# EAGLE design 32KRAM (EAGLE 6.6.0)

## Sheet 1 of 5
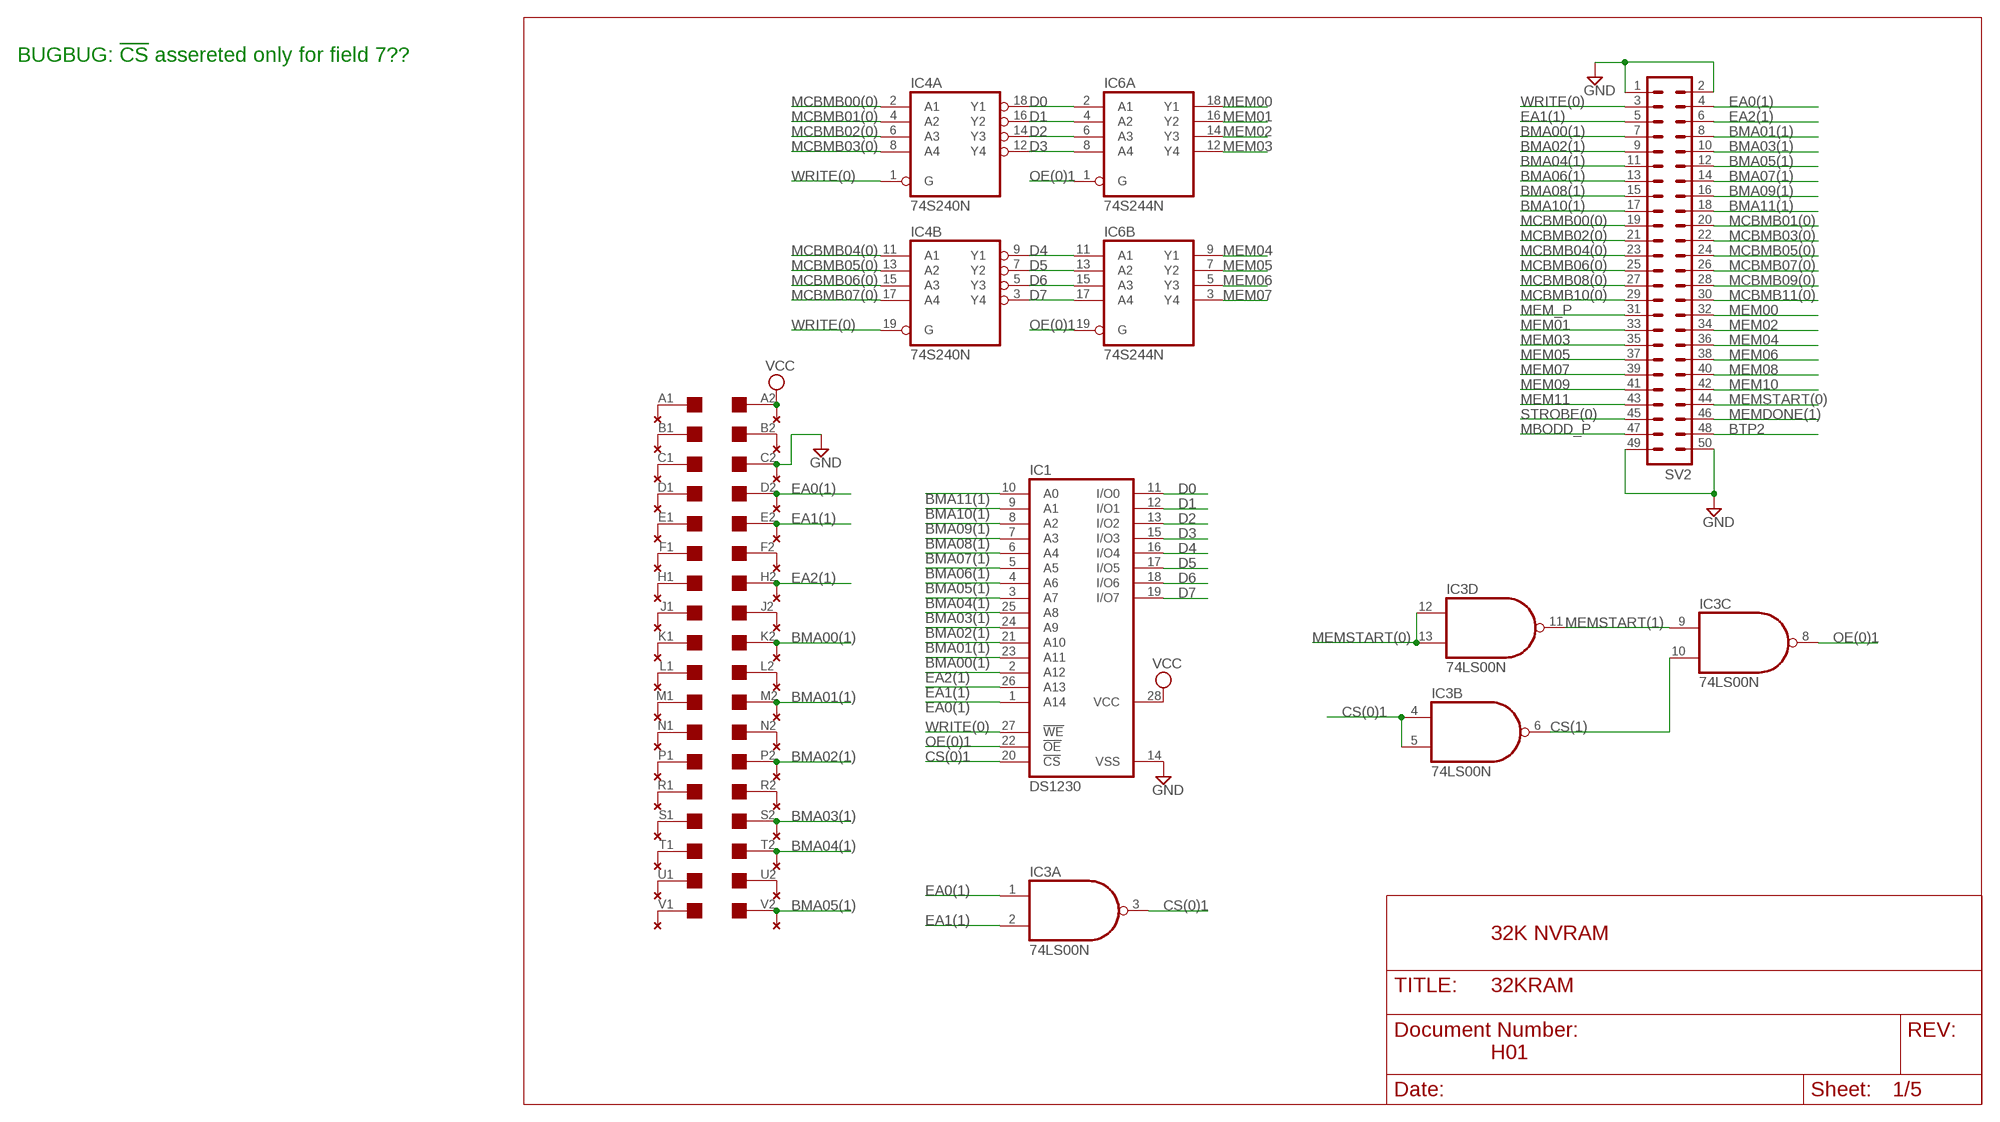
[diagram p0: schematic, sheet 1]

### Parts
EDGE1  EDGE-2CONNECTOR  [EDGE-CON2]
IC1  DS1230  62256P  [DIL28-6]
IC3  74LS00N  [DIL14]
IC4  74S240N  [DIL20]
IC6  74S244N  [DIL20]
SV2  ML50L  [ML50L]
U$1  THRU-HOLE2  [THRU-HOLEB]

### Nets
BMA00(1): EDGE1.K2 IC1.23(A11) SV2.7 U$1.K2 ; also sheet 2,3,5
BMA01(1): EDGE1.M2 IC1.21(A10) SV2.8 U$1.M2 ; also sheet 2,3,5
BMA02(1): EDGE1.P2 IC1.24(A9) SV2.9 U$1.P2 ; also sheet 2,3,5
BMA03(1): EDGE1.S2 IC1.25(A8) SV2.10 U$1.S2 ; also sheet 2,3,5
BMA04(1): EDGE1.T2 IC1.3(A7) SV2.11 U$1.T2 ; also sheet 2,3,5
BMA05(1): EDGE1.V2 IC1.4(A6) SV2.12 U$1.V2 ; also sheet 2,3,5
BMA06(1): IC1.5(A5) SV2.13 ; also sheet 2,3,5
BMA07(1): IC1.6(A4) SV2.14 ; also sheet 2,3,5
BMA08(1): IC1.7(A3) SV2.15 ; also sheet 2,3,5
BMA09(1): IC1.8(A2) SV2.16 ; also sheet 2,3,5
BMA10(1): IC1.9(A1) SV2.17 ; also sheet 2,3,5
BMA11(1): IC1.10(A0) SV2.18 ; also sheet 2,3,5
BTP2: SV2.48 ; also sheet 2,3,5
CS(0)1: IC1.20(!CS) IC3.3(A:O) IC3.4(B:I0) IC3.5(B:I1)
CS(1): IC3.6(B:O) IC3.10(C:I1)
D0: IC1.11(I/O0) IC4.18(A:Y1) IC6.2(A:A1)
D1: IC1.12(I/O1) IC4.16(A:Y2) IC6.4(A:A2)
D2: IC1.13(I/O2) IC4.14(A:Y3) IC6.6(A:A3)
D3: IC1.15(I/O3) IC4.12(A:Y4) IC6.8(A:A4)
D4: IC1.16(I/O4) IC4.9(B:Y1) IC6.11(B:A1)
D5: IC1.17(I/O5) IC4.7(B:Y2) IC6.13(B:A2)
D6: IC1.18(I/O6) IC4.5(B:Y3) IC6.15(B:A3)
D7: IC1.19(I/O7) IC4.3(B:Y4) IC6.17(B:A4)
EA0(1): EDGE1.D2 IC1.1(A14) IC3.1(A:I0) SV2.4 U$1.D2 ; also sheet 2,3,5
EA1(1): EDGE1.E2 IC1.26(A13) IC3.2(A:I1) SV2.5 U$1.E2 ; also sheet 2,3,5
EA2(1): EDGE1.H2 IC1.2(A12) SV2.6 U$1.H2 ; also sheet 2,3,5
GND: EDGE1.C2 IC1.14(VSS) SV2.1 SV2.2 SV2.49 SV2.50 U$1.C2 ; also sheet 2,3,5
MBODD_P: SV2.47 ; also sheet 2,3,5
MCBMB00(0): IC4.2(A:A1) SV2.19 ; also sheet 2,3,5
MCBMB01(0): IC4.4(A:A2) SV2.20 ; also sheet 2,3,5
MCBMB02(0): IC4.6(A:A3) SV2.21 ; also sheet 2,3,5
MCBMB03(0): IC4.8(A:A4) SV2.22 ; also sheet 2,3,5
MCBMB04(0): IC4.11(B:A1) SV2.23 ; also sheet 2,3,5
MCBMB05(0): IC4.13(B:A2) SV2.24 ; also sheet 2,3,5
MCBMB06(0): IC4.15(B:A3) SV2.25 ; also sheet 2,3,5
MCBMB07(0): IC4.17(B:A4) SV2.26 ; also sheet 2,3,5
MCBMB08(0): SV2.27 ; also sheet 2,3,5
MCBMB09(0): SV2.28 ; also sheet 2,3,5
MCBMB10(0): SV2.29 ; also sheet 2,3,5
MCBMB11(0): SV2.30 ; also sheet 2,3,5
MEM00: IC6.18(A:Y1) SV2.32 ; also sheet 2,3,5
MEM01: IC6.16(A:Y2) SV2.33 ; also sheet 2,3,5
MEM02: IC6.14(A:Y3) SV2.34 ; also sheet 2,3,5
MEM03: IC6.12(A:Y4) SV2.35 ; also sheet 2,3,5
MEM04: IC6.9(B:Y1) SV2.36 ; also sheet 2,3,5
MEM05: IC6.7(B:Y2) SV2.37 ; also sheet 2,3,5
MEM06: IC6.5(B:Y3) SV2.38 ; also sheet 2,3,5
MEM07: IC6.3(B:Y4) SV2.39 ; also sheet 2,3,5
MEM08: SV2.40 ; also sheet 2,3,5
MEM09: SV2.41 ; also sheet 2,3,5
MEM10: SV2.42 ; also sheet 2,3,5
MEM11: SV2.43 ; also sheet 2,3,5
MEM_P: SV2.31 ; also sheet 2,3,5
MEMDONE(1): SV2.46 ; also sheet 2,3,5
MEMSTART(0): IC3.12(D:I0) IC3.13(D:I1) SV2.44 ; also sheet 2,3,5
MEMSTART(1): IC3.9(C:I0) IC3.11(D:O)
N$1: EDGE1.L2 U$1.L2
N$3: EDGE1.N2 U$1.N2
N$5: EDGE1.R2 U$1.R2
N$9: EDGE1.J2 U$1.J2
N$11: EDGE1.F2 U$1.F2
N$15: EDGE1.U2 U$1.U2
N$17: EDGE1.B2 U$1.B2
N$19: EDGE1.K1 U$1.K1
N$20: EDGE1.L1 U$1.L1
N$21: EDGE1.M1 U$1.M1
N$22: EDGE1.N1 U$1.N1
N$23: EDGE1.P1 U$1.P1
N$24: EDGE1.R1 U$1.R1
N$25: EDGE1.S1 U$1.S1
N$26: EDGE1.T1 U$1.T1
N$27: EDGE1.U1 U$1.U1
N$28: EDGE1.V1 U$1.V1
N$29: EDGE1.J1 U$1.J1
N$30: EDGE1.H1 U$1.H1
N$31: EDGE1.F1 U$1.F1
N$32: EDGE1.E1 U$1.E1
N$33: EDGE1.D1 U$1.D1
N$34: EDGE1.C1 U$1.C1
N$35: EDGE1.B1 U$1.B1
N$36: EDGE1.A1 U$1.A1
OE(0)1: IC1.22(!OE) IC3.8(C:O) IC6.1(A:G) IC6.19(B:G)
STROBE(0): SV2.45 ; also sheet 2,3,5
VCC: EDGE1.A2 IC1.28(VCC) U$1.A2 ; also sheet 2,3,5
WRITE(0): IC1.27(!WE) IC4.1(A:G) IC4.19(B:G) SV2.3 ; also sheet 5

### Notes on the sheet
- BUGBUG: !CS! assereted only for field 7??
- 32K NVRAM
- H01

## Sheet 2 of 5
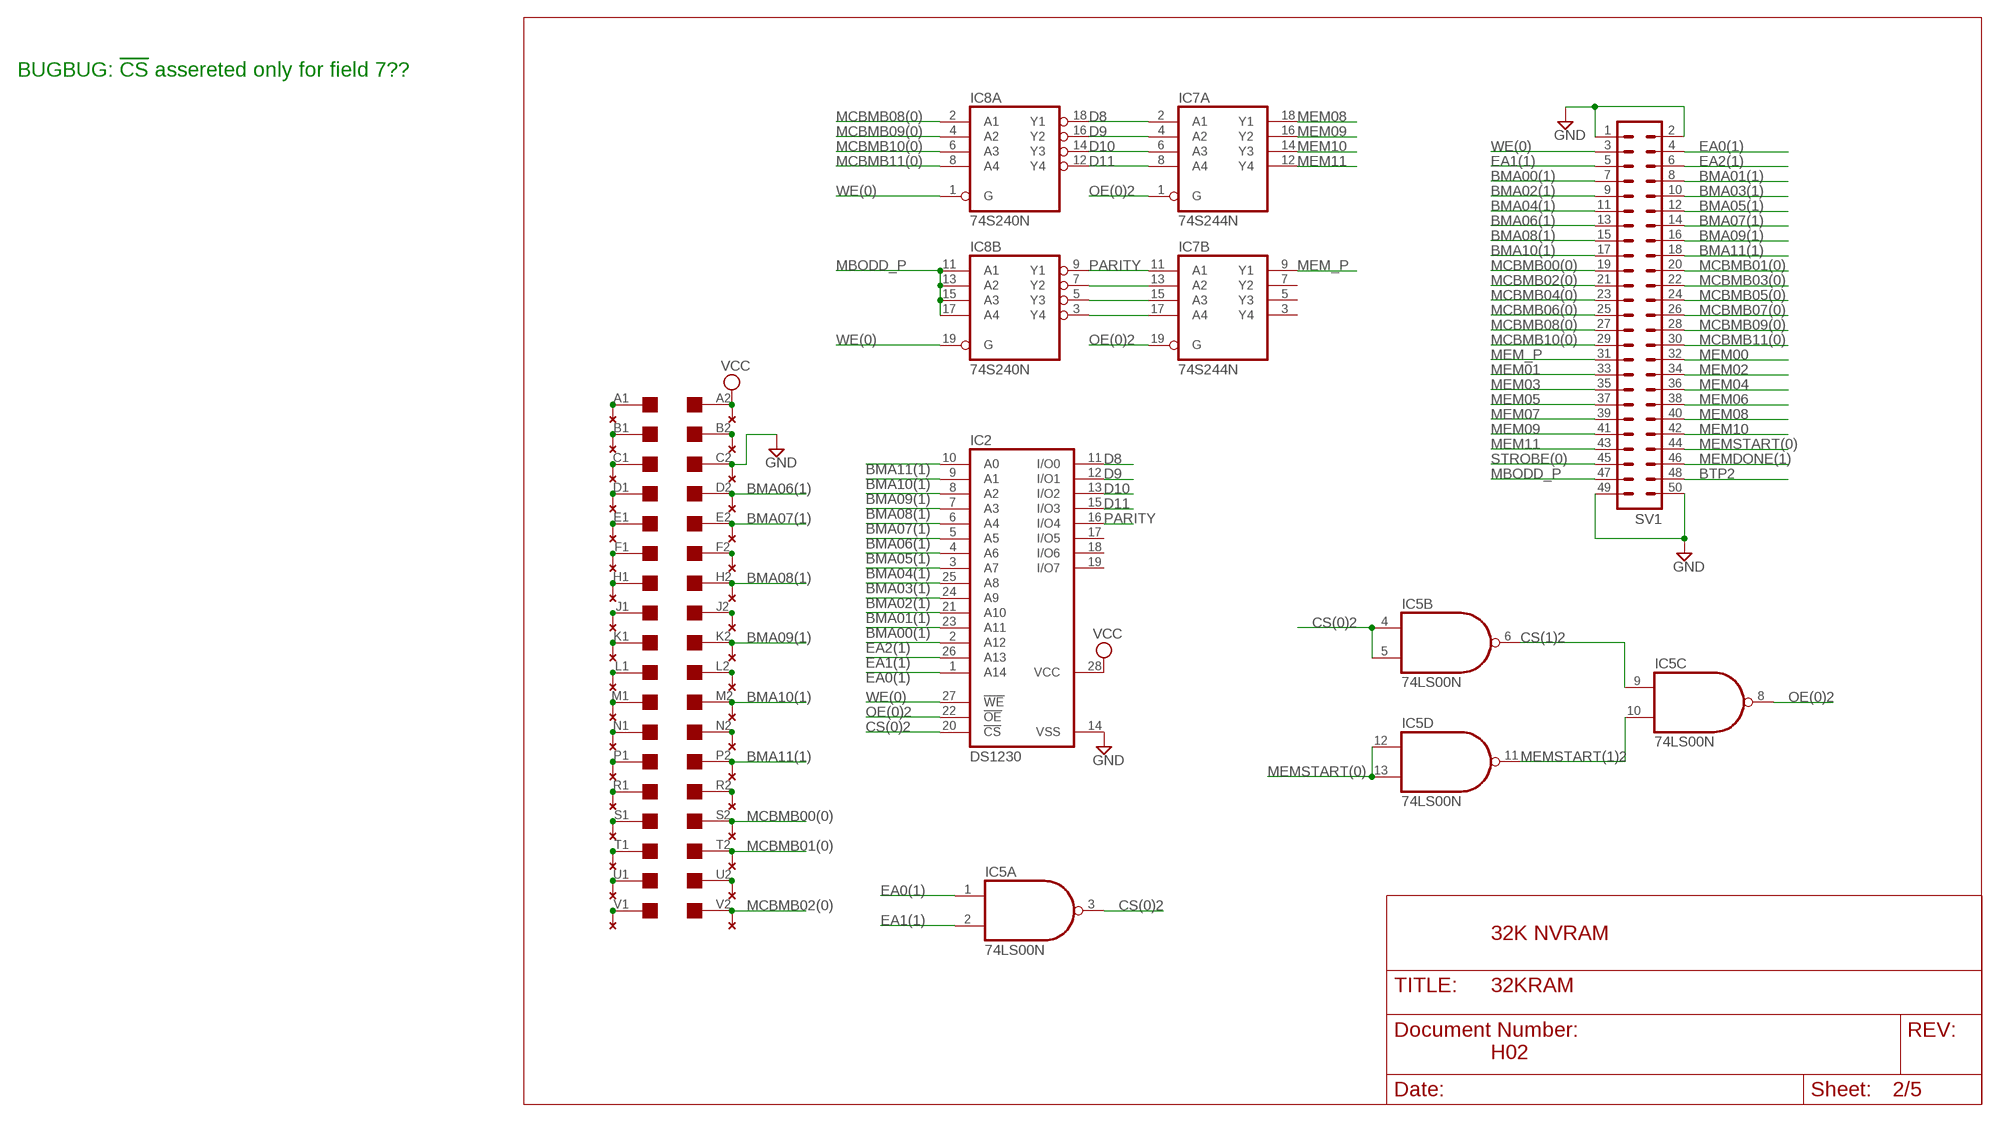
[diagram p1: schematic, sheet 2]

### Parts
EDGE2  EDGE-2CONNECTOR  [EDGE-CON2]
IC2  DS1230  62256P  [DIL28-6]
IC5  74LS00N  [DIL14]
IC7  74S244N  [DIL20]
IC8  74S240N  [DIL20]
SV1  ML50L  [ML50L]
U$2  THRU-HOLE2  [THRU-HOLEB]

### Nets
BMA00(1): IC2.23(A11) SV1.7 ; also sheet 1,3,5
BMA01(1): IC2.21(A10) SV1.8 ; also sheet 1,3,5
BMA02(1): IC2.24(A9) SV1.9 ; also sheet 1,3,5
BMA03(1): IC2.25(A8) SV1.10 ; also sheet 1,3,5
BMA04(1): IC2.3(A7) SV1.11 ; also sheet 1,3,5
BMA05(1): IC2.4(A6) SV1.12 ; also sheet 1,3,5
BMA06(1): EDGE2.D2 IC2.5(A5) SV1.13 U$2.D2 ; also sheet 1,3,5
BMA07(1): EDGE2.E2 IC2.6(A4) SV1.14 U$2.E2 ; also sheet 1,3,5
BMA08(1): EDGE2.H2 IC2.7(A3) SV1.15 U$2.H2 ; also sheet 1,3,5
BMA09(1): EDGE2.K2 IC2.8(A2) SV1.16 U$2.K2 ; also sheet 1,3,5
BMA10(1): EDGE2.M2 IC2.9(A1) SV1.17 U$2.M2 ; also sheet 1,3,5
BMA11(1): EDGE2.P2 IC2.10(A0) SV1.18 U$2.P2 ; also sheet 1,3,5
BTP2: SV1.48 ; also sheet 1,3,5
CS(0)2: IC2.20(!CS) IC5.3(A:O) IC5.4(B:I0) IC5.5(B:I1)
CS(1)2: IC5.6(B:O) IC5.9(C:I0)
D8: IC2.11(I/O0) IC7.2(A:A1) IC8.18(A:Y1)
D9: IC2.12(I/O1) IC7.4(A:A2) IC8.16(A:Y2)
D10: IC2.13(I/O2) IC7.6(A:A3) IC8.14(A:Y3)
D11: IC2.15(I/O3) IC7.8(A:A4) IC8.12(A:Y4)
EA0(1): IC2.1(A14) IC5.1(A:I0) SV1.4 ; also sheet 1,3,5
EA1(1): IC2.26(A13) IC5.2(A:I1) SV1.5 ; also sheet 1,3,5
EA2(1): IC2.2(A12) SV1.6 ; also sheet 1,3,5
GND: EDGE2.C2 IC2.14(VSS) SV1.1 SV1.2 SV1.49 SV1.50 U$2.C2 ; also sheet 1,3,5
MBODD_P: IC8.11(B:A1) IC8.13(B:A2) IC8.15(B:A3) IC8.17(B:A4) SV1.47 ; also sheet 1,3,5
MCBMB00(0): EDGE2.S2 SV1.19 U$2.S2 ; also sheet 1,3,5
MCBMB01(0): EDGE2.T2 SV1.20 U$2.T2 ; also sheet 1,3,5
MCBMB02(0): EDGE2.V2 SV1.21 U$2.V2 ; also sheet 1,3,5
MCBMB03(0): SV1.22 ; also sheet 1,3,5
MCBMB04(0): SV1.23 ; also sheet 1,3,5
MCBMB05(0): SV1.24 ; also sheet 1,3,5
MCBMB06(0): SV1.25 ; also sheet 1,3,5
MCBMB07(0): SV1.26 ; also sheet 1,3,5
MCBMB08(0): IC8.2(A:A1) SV1.27 ; also sheet 1,3,5
MCBMB09(0): IC8.4(A:A2) SV1.28 ; also sheet 1,3,5
MCBMB10(0): IC8.6(A:A3) SV1.29 ; also sheet 1,3,5
MCBMB11(0): IC8.8(A:A4) SV1.30 ; also sheet 1,3,5
MEM00: SV1.32 ; also sheet 1,3,5
MEM01: SV1.33 ; also sheet 1,3,5
MEM02: SV1.34 ; also sheet 1,3,5
MEM03: SV1.35 ; also sheet 1,3,5
MEM04: SV1.36 ; also sheet 1,3,5
MEM05: SV1.37 ; also sheet 1,3,5
MEM06: SV1.38 ; also sheet 1,3,5
MEM07: SV1.39 ; also sheet 1,3,5
MEM08: IC7.18(A:Y1) SV1.40 ; also sheet 1,3,5
MEM09: IC7.16(A:Y2) SV1.41 ; also sheet 1,3,5
MEM10: IC7.14(A:Y3) SV1.42 ; also sheet 1,3,5
MEM11: IC7.12(A:Y4) SV1.43 ; also sheet 1,3,5
MEM_P: IC7.9(B:Y1) SV1.31 ; also sheet 1,3,5
MEMDONE(1): SV1.46 ; also sheet 1,3,5
MEMSTART(0): IC5.12(D:I0) IC5.13(D:I1) SV1.44 ; also sheet 1,3,5
MEMSTART(1)2: IC5.10(C:I1) IC5.11(D:O)
N$2: IC7.13(B:A2) IC8.7(B:Y2)
N$4: IC7.15(B:A3) IC8.5(B:Y3)
N$6: IC7.17(B:A4) IC8.3(B:Y4)
N$7: EDGE2.L2 U$2.L2
N$8: EDGE2.N2 U$2.N2
N$10: EDGE2.R2 U$2.R2
N$12: EDGE2.J2 U$2.J2
N$13: EDGE2.F2 U$2.F2
N$14: EDGE2.U2 U$2.U2
N$16: EDGE2.B2 U$2.B2
N$18: EDGE2.K1 U$2.K1
N$37: EDGE2.L1 U$2.L1
N$38: EDGE2.M1 U$2.M1
N$39: EDGE2.N1 U$2.N1
N$40: EDGE2.P1 U$2.P1
N$41: EDGE2.R1 U$2.R1
N$42: EDGE2.S1 U$2.S1
N$43: EDGE2.T1 U$2.T1
N$47: EDGE2.U1 U$2.U1
N$48: EDGE2.V1 U$2.V1
N$49: EDGE2.J1 U$2.J1
N$50: EDGE2.H1 U$2.H1
N$51: EDGE2.F1 U$2.F1
N$52: EDGE2.E1 U$2.E1
N$53: EDGE2.D1 U$2.D1
N$54: EDGE2.C1 U$2.C1
N$55: EDGE2.B1 U$2.B1
N$56: EDGE2.A1 U$2.A1
OE(0)2: IC2.22(!OE) IC5.8(C:O) IC7.1(A:G) IC7.19(B:G)
PARITY: IC2.16(I/O4) IC7.11(B:A1) IC8.9(B:Y1)
STROBE(0): SV1.45 ; also sheet 1,3,5
VCC: EDGE2.A2 IC2.28(VCC) U$2.A2 ; also sheet 1,3,5
WE(0): IC2.27(!WE) IC8.1(A:G) IC8.19(B:G) SV1.3 ; also sheet 3
Unconnected: IC2.17(I/O5) IC2.18(I/O6) IC2.19(I/O7) IC7.3(B:Y4) IC7.5(B:Y3) IC7.7(B:Y2)

### Notes on the sheet
- BUGBUG: !CS! assereted only for field 7??
- 32K NVRAM
- H02

## Sheet 3 of 5
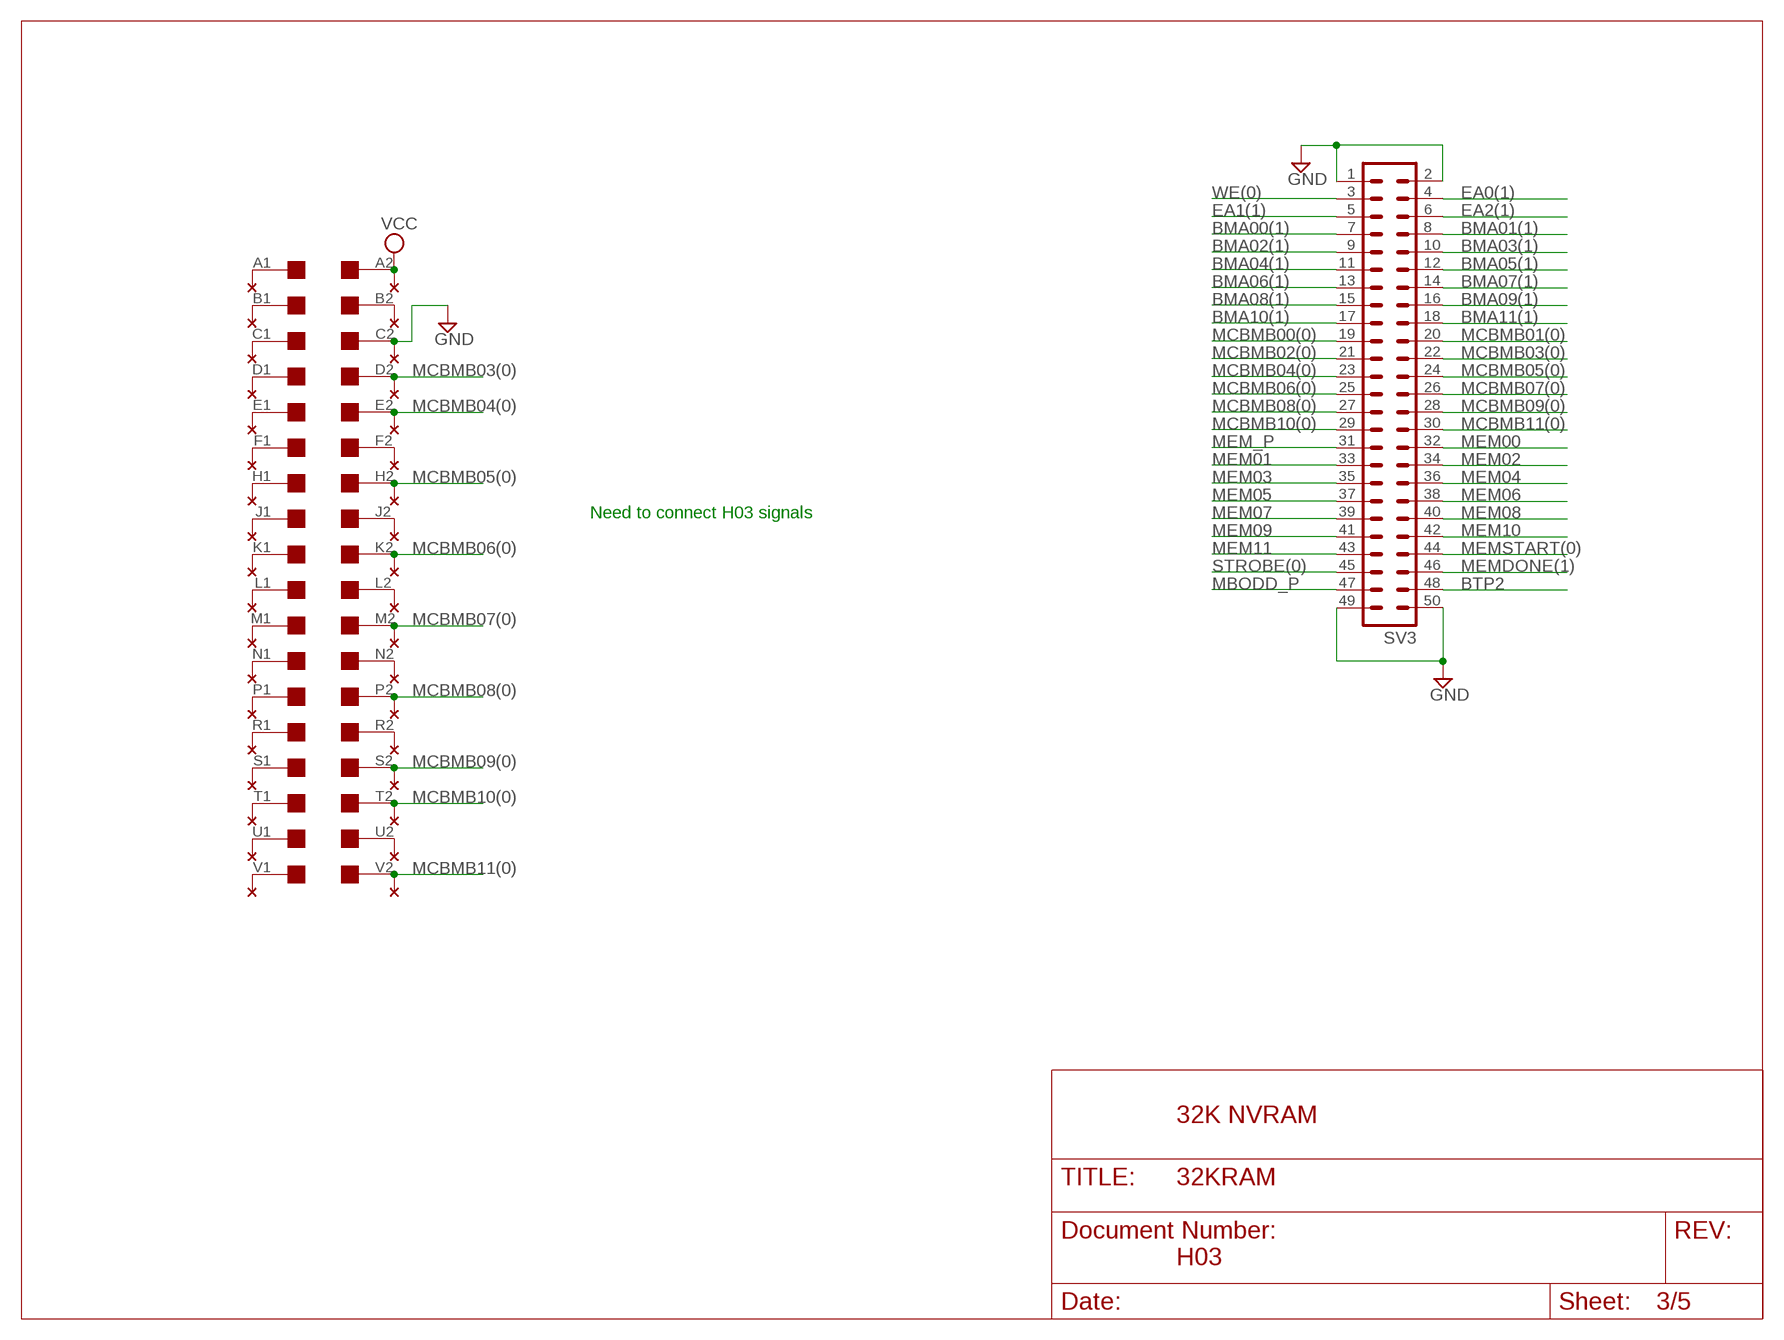
[diagram p2: schematic, sheet 3]

### Parts
EDGE3  EDGE-2CONNECTOR  [EDGE-CON2]
SV3  ML50L  [ML50L]
U$3  THRU-HOLE2  [THRU-HOLEB]

### Nets
BMA00(1): SV3.7 ; also sheet 1,2,5
BMA01(1): SV3.8 ; also sheet 1,2,5
BMA02(1): SV3.9 ; also sheet 1,2,5
BMA03(1): SV3.10 ; also sheet 1,2,5
BMA04(1): SV3.11 ; also sheet 1,2,5
BMA05(1): SV3.12 ; also sheet 1,2,5
BMA06(1): SV3.13 ; also sheet 1,2,5
BMA07(1): SV3.14 ; also sheet 1,2,5
BMA08(1): SV3.15 ; also sheet 1,2,5
BMA09(1): SV3.16 ; also sheet 1,2,5
BMA10(1): SV3.17 ; also sheet 1,2,5
BMA11(1): SV3.18 ; also sheet 1,2,5
BTP2: SV3.48 ; also sheet 1,2,5
EA0(1): SV3.4 ; also sheet 1,2,5
EA1(1): SV3.5 ; also sheet 1,2,5
EA2(1): SV3.6 ; also sheet 1,2,5
GND: EDGE3.C2 SV3.1 SV3.2 SV3.49 SV3.50 U$3.C2 ; also sheet 1,2,5
MBODD_P: SV3.47 ; also sheet 1,2,5
MCBMB00(0): SV3.19 ; also sheet 1,2,5
MCBMB01(0): SV3.20 ; also sheet 1,2,5
MCBMB02(0): SV3.21 ; also sheet 1,2,5
MCBMB03(0): EDGE3.D2 SV3.22 U$3.D2 ; also sheet 1,2,5
MCBMB04(0): EDGE3.E2 SV3.23 U$3.E2 ; also sheet 1,2,5
MCBMB05(0): EDGE3.H2 SV3.24 U$3.H2 ; also sheet 1,2,5
MCBMB06(0): EDGE3.K2 SV3.25 U$3.K2 ; also sheet 1,2,5
MCBMB07(0): EDGE3.M2 SV3.26 U$3.M2 ; also sheet 1,2,5
MCBMB08(0): EDGE3.P2 SV3.27 U$3.P2 ; also sheet 1,2,5
MCBMB09(0): EDGE3.S2 SV3.28 U$3.S2 ; also sheet 1,2,5
MCBMB10(0): EDGE3.T2 SV3.29 U$3.T2 ; also sheet 1,2,5
MCBMB11(0): EDGE3.V2 SV3.30 U$3.V2 ; also sheet 1,2,5
MEM00: SV3.32 ; also sheet 1,2,5
MEM01: SV3.33 ; also sheet 1,2,5
MEM02: SV3.34 ; also sheet 1,2,5
MEM03: SV3.35 ; also sheet 1,2,5
MEM04: SV3.36 ; also sheet 1,2,5
MEM05: SV3.37 ; also sheet 1,2,5
MEM06: SV3.38 ; also sheet 1,2,5
MEM07: SV3.39 ; also sheet 1,2,5
MEM08: SV3.40 ; also sheet 1,2,5
MEM09: SV3.41 ; also sheet 1,2,5
MEM10: SV3.42 ; also sheet 1,2,5
MEM11: SV3.43 ; also sheet 1,2,5
MEM_P: SV3.31 ; also sheet 1,2,5
MEMDONE(1): SV3.46 ; also sheet 1,2,5
MEMSTART(0): SV3.44 ; also sheet 1,2,5
N$57: EDGE3.J2 U$3.J2
N$58: EDGE3.L2 U$3.L2
N$59: EDGE3.N2 U$3.N2
N$60: EDGE3.F2 U$3.F2
N$61: EDGE3.R2 U$3.R2
N$62: EDGE3.B2 U$3.B2
N$63: EDGE3.U2 U$3.U2
N$64: EDGE3.A1 U$3.A1
N$65: EDGE3.V1 U$3.V1
N$66: EDGE3.U1 U$3.U1
N$67: EDGE3.T1 U$3.T1
N$68: EDGE3.S1 U$3.S1
N$69: EDGE3.R1 U$3.R1
N$70: EDGE3.P1 U$3.P1
N$71: EDGE3.N1 U$3.N1
N$72: EDGE3.M1 U$3.M1
N$73: EDGE3.L1 U$3.L1
N$74: EDGE3.K1 U$3.K1
N$75: EDGE3.J1 U$3.J1
N$76: EDGE3.H1 U$3.H1
N$77: EDGE3.F1 U$3.F1
N$78: EDGE3.E1 U$3.E1
N$79: EDGE3.D1 U$3.D1
N$80: EDGE3.C1 U$3.C1
N$81: EDGE3.B1 U$3.B1
STROBE(0): SV3.45 ; also sheet 1,2,5
VCC: EDGE3.A2 U$3.A2 ; also sheet 1,2,5
WE(0): SV3.3 ; also sheet 2

### Notes on the sheet
- Need to connect H03 signals
- 32K NVRAM
- H03

## Sheet 4 of 5
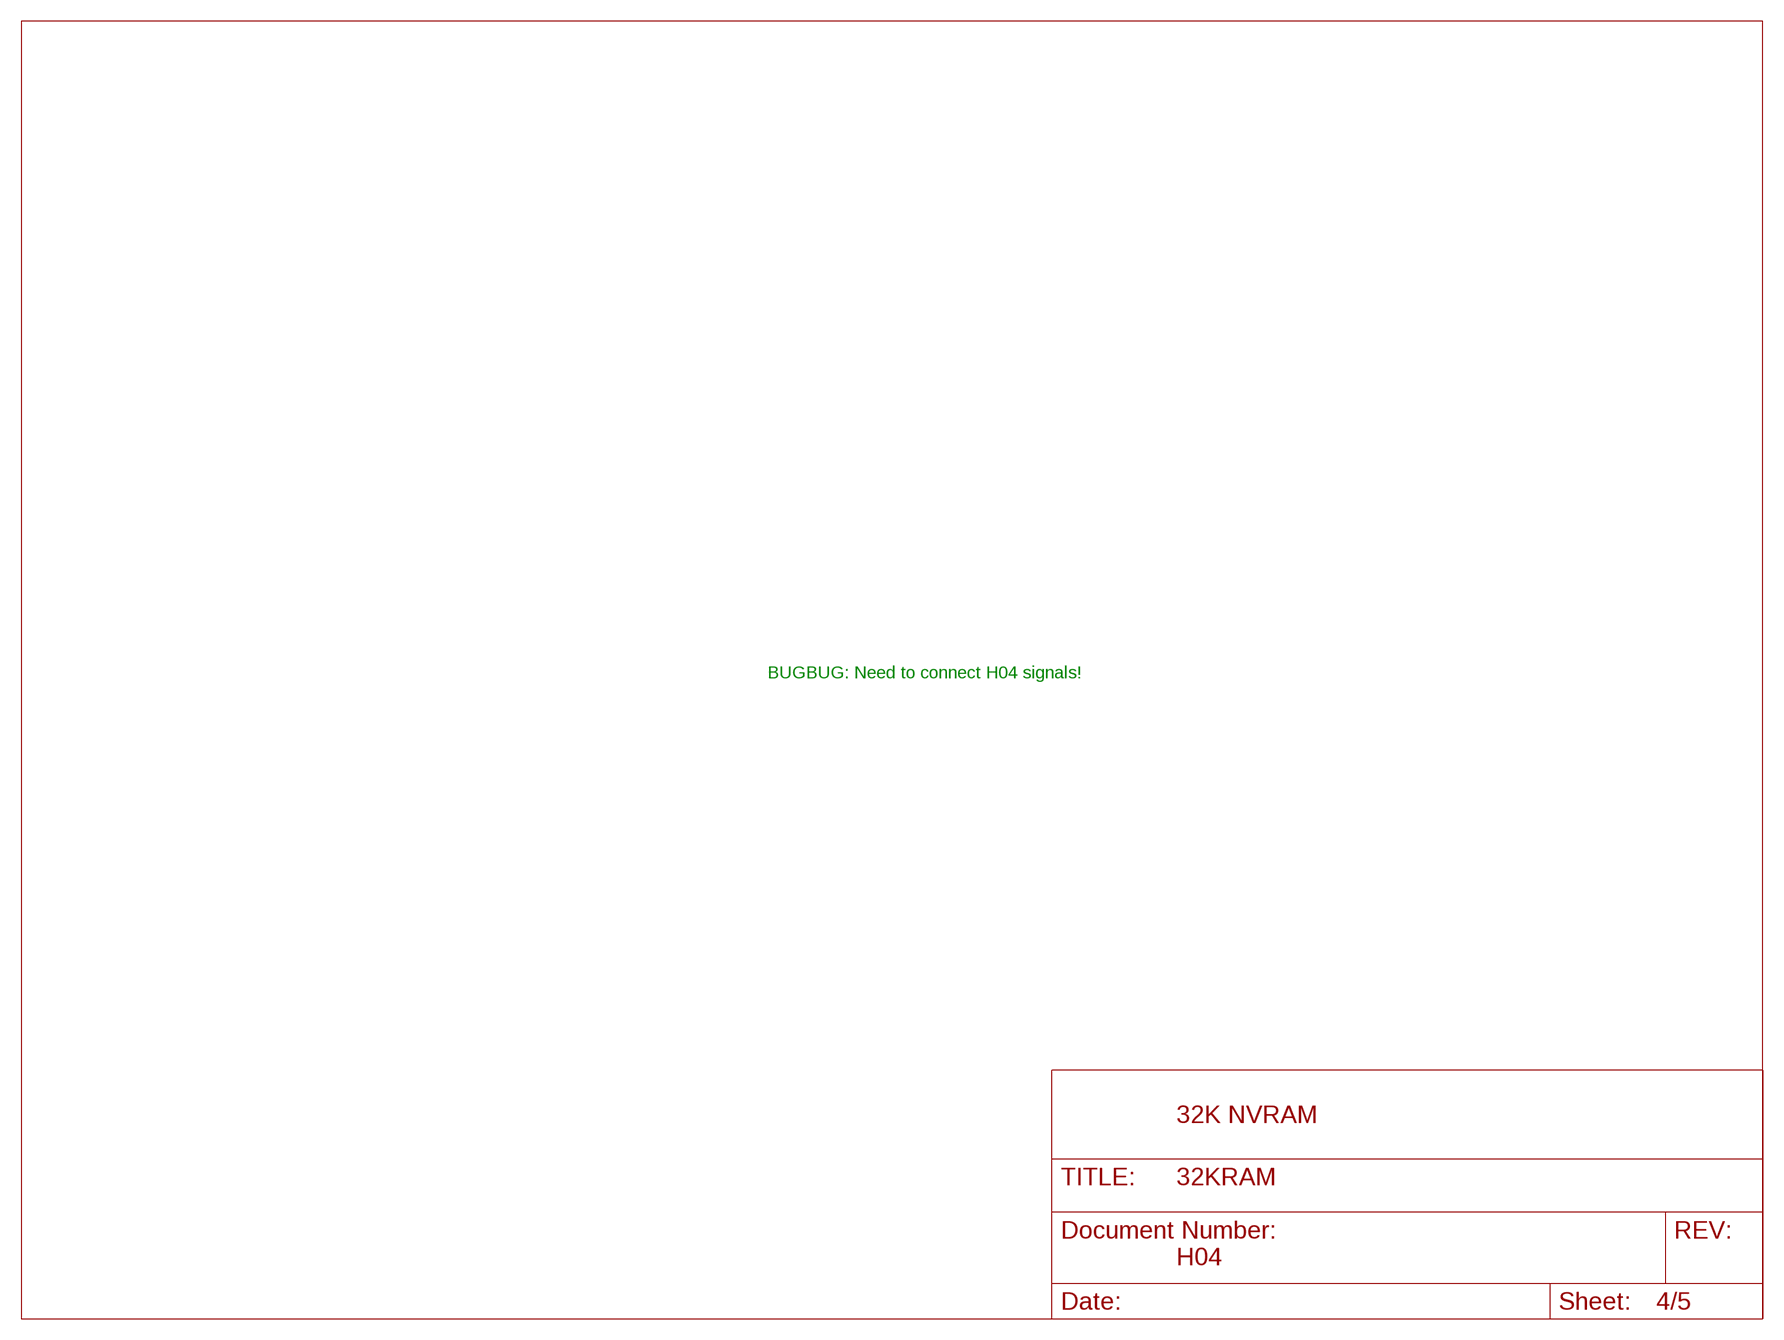
[diagram p3: schematic, sheet 4]

### Notes on the sheet
- BUGBUG: Need to connect H04 signals!
- 32K NVRAM
- H04

## Sheet 5 of 5
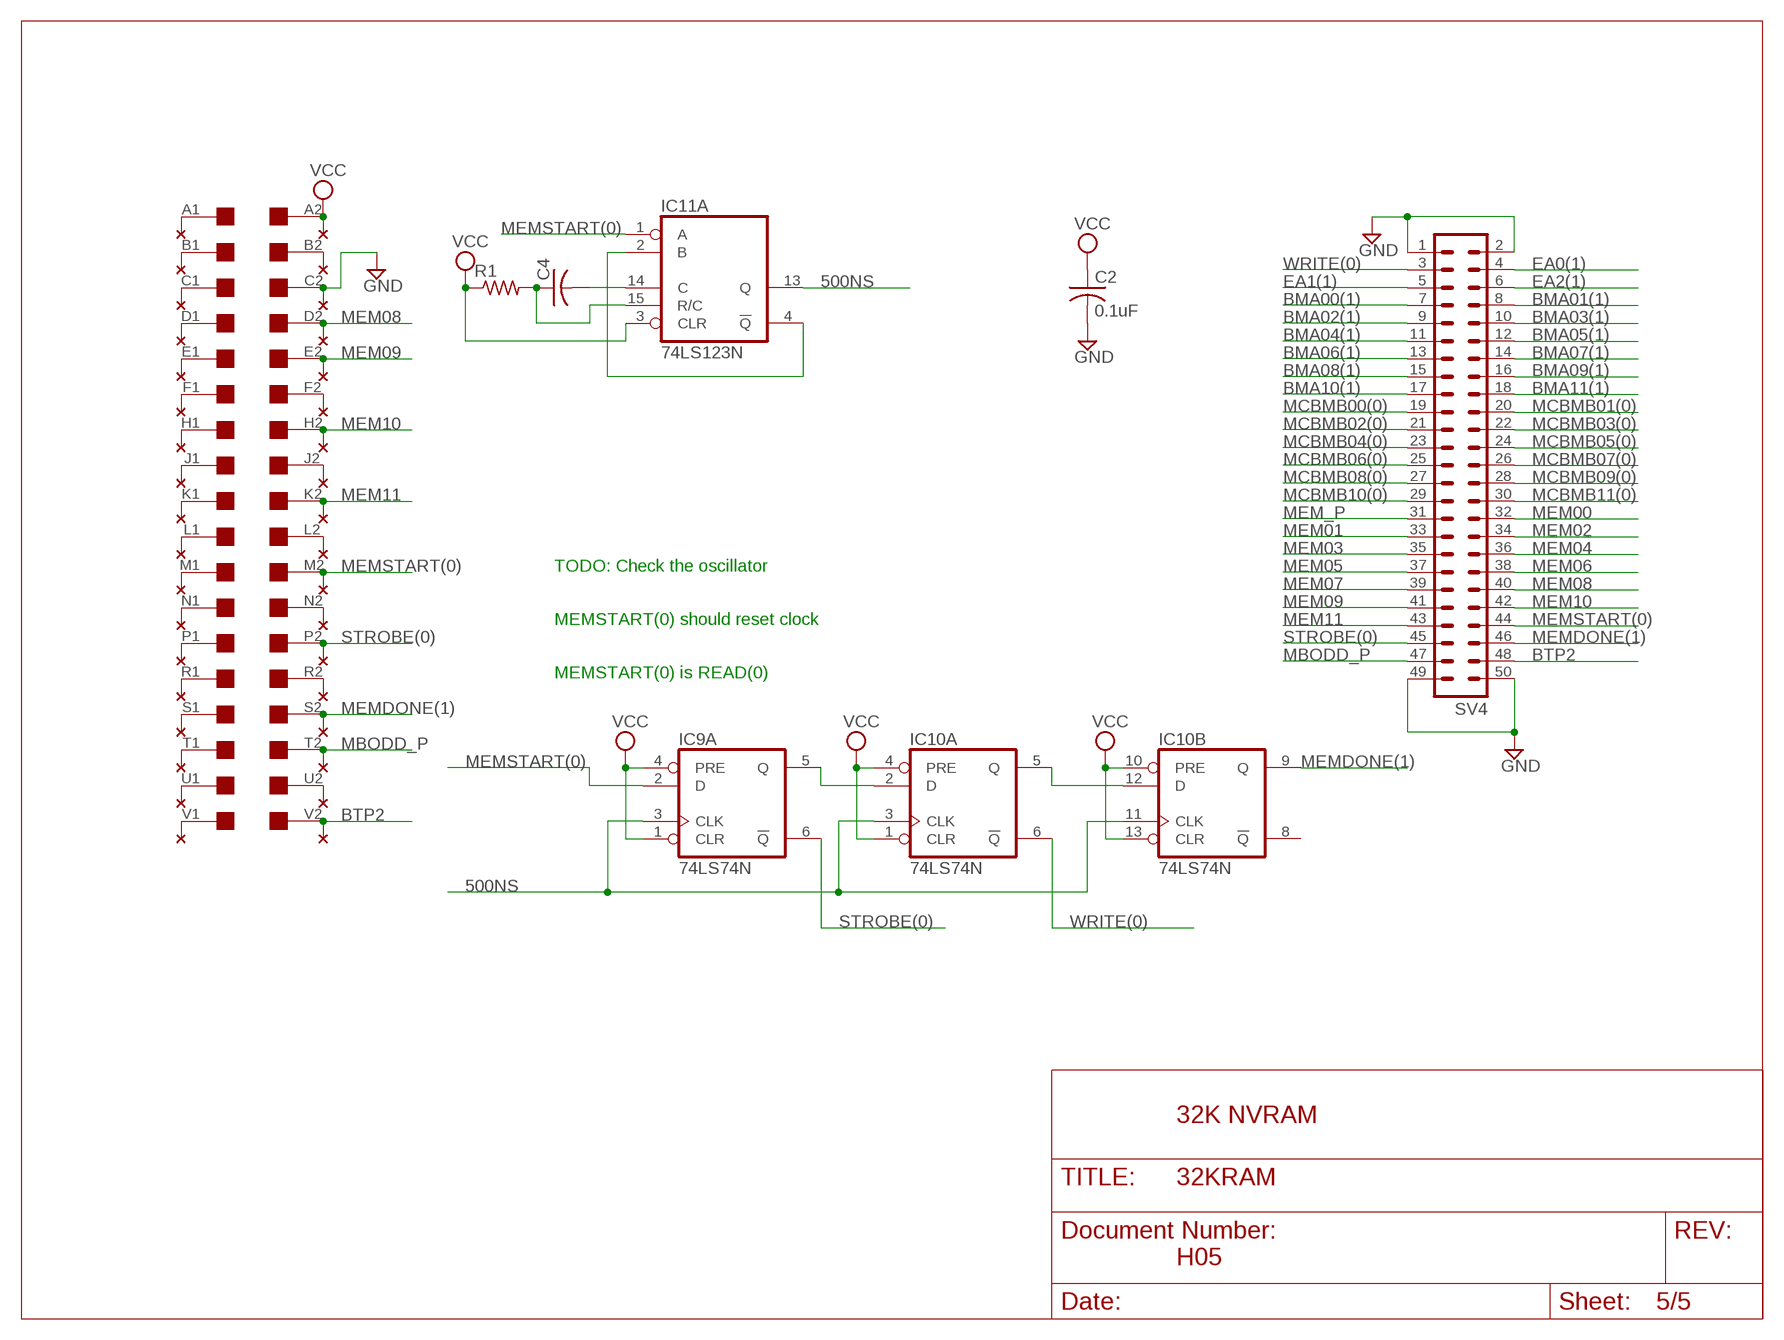
[diagram p4: schematic, sheet 5]

### Parts
C2  0.1uF  C-US050-025X075  [C050-025X075]
C4  C-US050-025X075  [C050-025X075]
EDGE5  EDGE-2CONNECTOR  [EDGE-CON2]
IC9  74LS74N  [DIL14]
IC10  74LS74N  [DIL14]
IC11  74LS123N  [DIL16]
R1  R-US_0309/10  [0309/10]
SV4  ML50L  [ML50L]
U$5  THRU-HOLE2  [THRU-HOLEB]

### Nets
500NS: IC9.3(A:CLK) IC10.3(A:CLK) IC10.11(B:CLK) IC11.13(A:Q)
BMA00(1): SV4.7 ; also sheet 1,2,3
BMA01(1): SV4.8 ; also sheet 1,2,3
BMA02(1): SV4.9 ; also sheet 1,2,3
BMA03(1): SV4.10 ; also sheet 1,2,3
BMA04(1): SV4.11 ; also sheet 1,2,3
BMA05(1): SV4.12 ; also sheet 1,2,3
BMA06(1): SV4.13 ; also sheet 1,2,3
BMA07(1): SV4.14 ; also sheet 1,2,3
BMA08(1): SV4.15 ; also sheet 1,2,3
BMA09(1): SV4.16 ; also sheet 1,2,3
BMA10(1): SV4.17 ; also sheet 1,2,3
BMA11(1): SV4.18 ; also sheet 1,2,3
BTP2: EDGE5.V2 SV4.48 U$5.V2 ; also sheet 1,2,3
EA0(1): SV4.4 ; also sheet 1,2,3
EA1(1): SV4.5 ; also sheet 1,2,3
EA2(1): SV4.6 ; also sheet 1,2,3
GND: C2.2 EDGE5.C2 SV4.1 SV4.2 SV4.49 SV4.50 U$5.C2 ; also sheet 1,2,3
MBODD_P: EDGE5.T2 SV4.47 U$5.T2 ; also sheet 1,2,3
MCBMB00(0): SV4.19 ; also sheet 1,2,3
MCBMB01(0): SV4.20 ; also sheet 1,2,3
MCBMB02(0): SV4.21 ; also sheet 1,2,3
MCBMB03(0): SV4.22 ; also sheet 1,2,3
MCBMB04(0): SV4.23 ; also sheet 1,2,3
MCBMB05(0): SV4.24 ; also sheet 1,2,3
MCBMB06(0): SV4.25 ; also sheet 1,2,3
MCBMB07(0): SV4.26 ; also sheet 1,2,3
MCBMB08(0): SV4.27 ; also sheet 1,2,3
MCBMB09(0): SV4.28 ; also sheet 1,2,3
MCBMB10(0): SV4.29 ; also sheet 1,2,3
MCBMB11(0): SV4.30 ; also sheet 1,2,3
MEM00: SV4.32 ; also sheet 1,2,3
MEM01: SV4.33 ; also sheet 1,2,3
MEM02: SV4.34 ; also sheet 1,2,3
MEM03: SV4.35 ; also sheet 1,2,3
MEM04: SV4.36 ; also sheet 1,2,3
MEM05: SV4.37 ; also sheet 1,2,3
MEM06: SV4.38 ; also sheet 1,2,3
MEM07: SV4.39 ; also sheet 1,2,3
MEM08: EDGE5.D2 SV4.40 U$5.D2 ; also sheet 1,2,3
MEM09: EDGE5.E2 SV4.41 U$5.E2 ; also sheet 1,2,3
MEM10: EDGE5.H2 SV4.42 U$5.H2 ; also sheet 1,2,3
MEM11: EDGE5.K2 SV4.43 U$5.K2 ; also sheet 1,2,3
MEM_P: SV4.31 ; also sheet 1,2,3
MEMDONE(1): EDGE5.S2 IC10.9(B:Q) SV4.46 U$5.S2 ; also sheet 1,2,3
MEMSTART(0): EDGE5.M2 IC9.2(A:D) IC11.1(A:A) SV4.44 U$5.M2 ; also sheet 1,2,3
N$82: IC9.5(A:Q) IC10.2(A:D)
N$83: IC10.5(A:Q) IC10.12(B:D)
N$84: IC11.2(A:B) IC11.4(A:!Q)
N$85: C4.2 IC11.14(A:C)
N$86: C4.1 IC11.15(A:R/C) R1.2
N$87: EDGE5.J2 U$5.J2
N$88: EDGE5.L2 U$5.L2
N$89: EDGE5.N2 U$5.N2
N$90: EDGE5.F2 U$5.F2
N$91: EDGE5.R2 U$5.R2
N$92: EDGE5.B2 U$5.B2
N$93: EDGE5.U2 U$5.U2
N$94: EDGE5.A1 U$5.A1
N$95: EDGE5.V1 U$5.V1
N$96: EDGE5.U1 U$5.U1
N$97: EDGE5.T1 U$5.T1
N$98: EDGE5.S1 U$5.S1
N$99: EDGE5.R1 U$5.R1
N$100: EDGE5.P1 U$5.P1
N$101: EDGE5.N1 U$5.N1
N$102: EDGE5.M1 U$5.M1
N$103: EDGE5.L1 U$5.L1
N$104: EDGE5.K1 U$5.K1
N$105: EDGE5.J1 U$5.J1
N$106: EDGE5.H1 U$5.H1
N$107: EDGE5.F1 U$5.F1
N$108: EDGE5.E1 U$5.E1
N$109: EDGE5.D1 U$5.D1
N$110: EDGE5.C1 U$5.C1
N$111: EDGE5.B1 U$5.B1
STROBE(0): EDGE5.P2 IC9.6(A:!Q) SV4.45 U$5.P2 ; also sheet 1,2,3
VCC: C2.1 EDGE5.A2 IC9.1(A:CLR) IC9.4(A:PRE) IC10.1(A:CLR) IC10.4(A:PRE) IC10.10(B:PRE) IC10.13(B:CLR) IC11.3(A:CLR) R1.1 U$5.A2 ; also sheet 1,2,3
WRITE(0): IC10.6(A:!Q) SV4.3 ; also sheet 1
Unconnected: IC9.8(B:!Q) IC9.9(B:Q) IC9.10(B:PRE) IC9.11(B:CLK) IC9.12(B:D) IC9.13(B:CLR) IC10.8(B:!Q) IC11.5(B:Q) IC11.6(B:C) IC11.7(B:R/C) IC11.9(B:A) IC11.10(B:B) IC11.11(B:CLR) IC11.12(B:!Q)

### Notes on the sheet
- TODO: Check the oscillator
- MEMSTART(0) should reset clock
- MEMSTART(0) is READ(0)
- 32K NVRAM
- H05

## Power pins joined to a net without a drawn wire
GND: IC3.7(P:GND) IC4.10(P:GND) IC5.7(P:GND) IC6.10(P:GND) IC7.10(P:GND) IC8.10(P:GND) IC9.7(P:GND) IC10.7(P:GND) IC11.8(P:GND)
VCC: IC3.14(P:VCC) IC4.20(P:VCC) IC5.14(P:VCC) IC6.20(P:VCC) IC7.20(P:VCC) IC8.20(P:VCC) IC9.14(P:VCC) IC10.14(P:VCC) IC11.16(P:VCC)

## Library data of the parts
C2 C4 = rcl:C-US: CAPACITOR, American symbol
EDGE1-EDGE3 EDGE5 = dec-con:EDGE-2: Double-Sided DEC edge connector.
IC1 IC2 = memory-hitachi:62256P: MEMORY; OC_FARNELL: unknown; OC_NEWARK: unknown
IC3 IC5 = 74xx-us:74*00: Quad 2-input NAND gate
IC4 IC8 = 74xx-us:74*240: Octal BUFFER and LINE DRIVER, 3-state
IC6 IC7 = 74xx-us:74*244: Octal BUFFER and LINE DRIVER, 3-state
IC9 IC10 = 74xx-us:74*74: Dual D type positive edge triggered FLIP FLOP, preset and clear
IC11 = 74xx-us:74*123: Retriggerable monostable MULTIVIBRATOR
R1 = rcl:R-US_: RESISTOR, American symbol
SV1-SV4 = con-ml:ML50L: HARTING; OC_FARNELL: unknown; OC_NEWARK: unknown
U$1-U$3 U$5 = dec-con:THRU-HOLE2: Thru-Hole addition to double-sided edge connector.

## Board
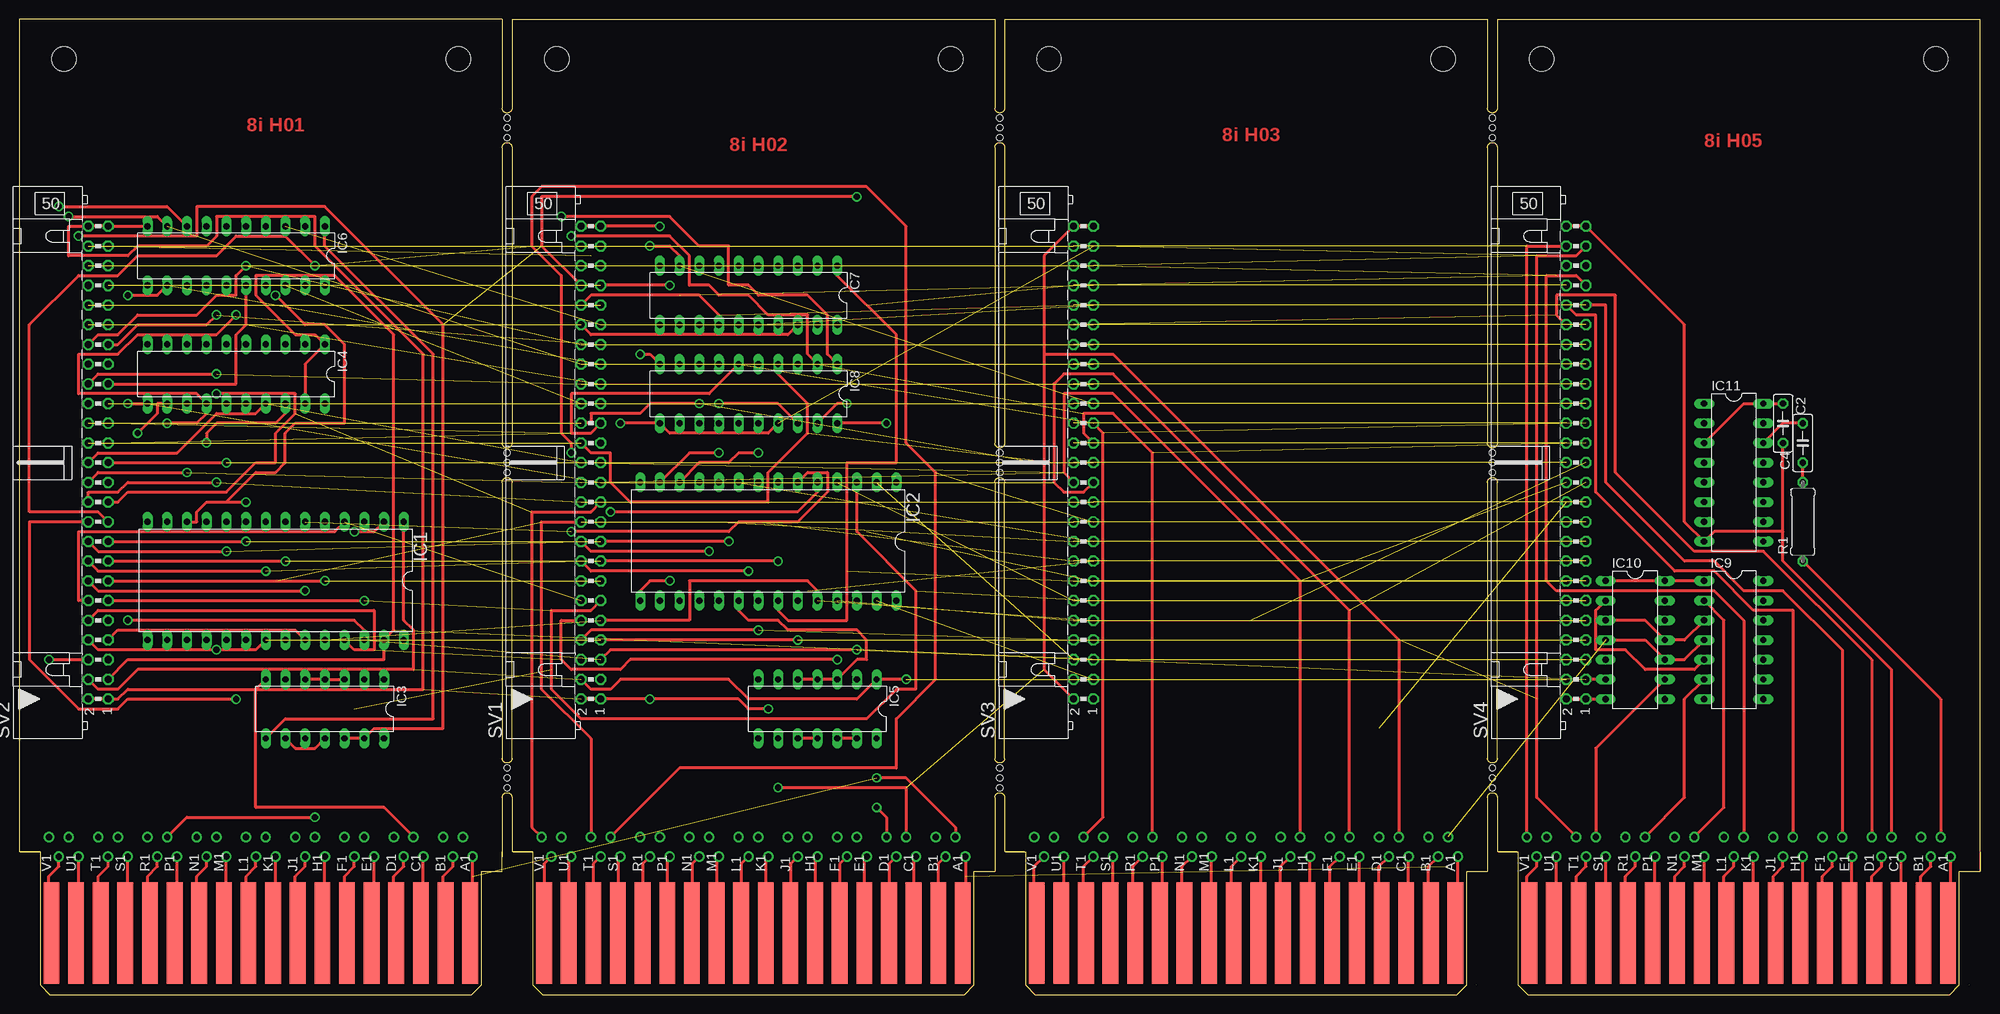
[diagram p5: board, top side]
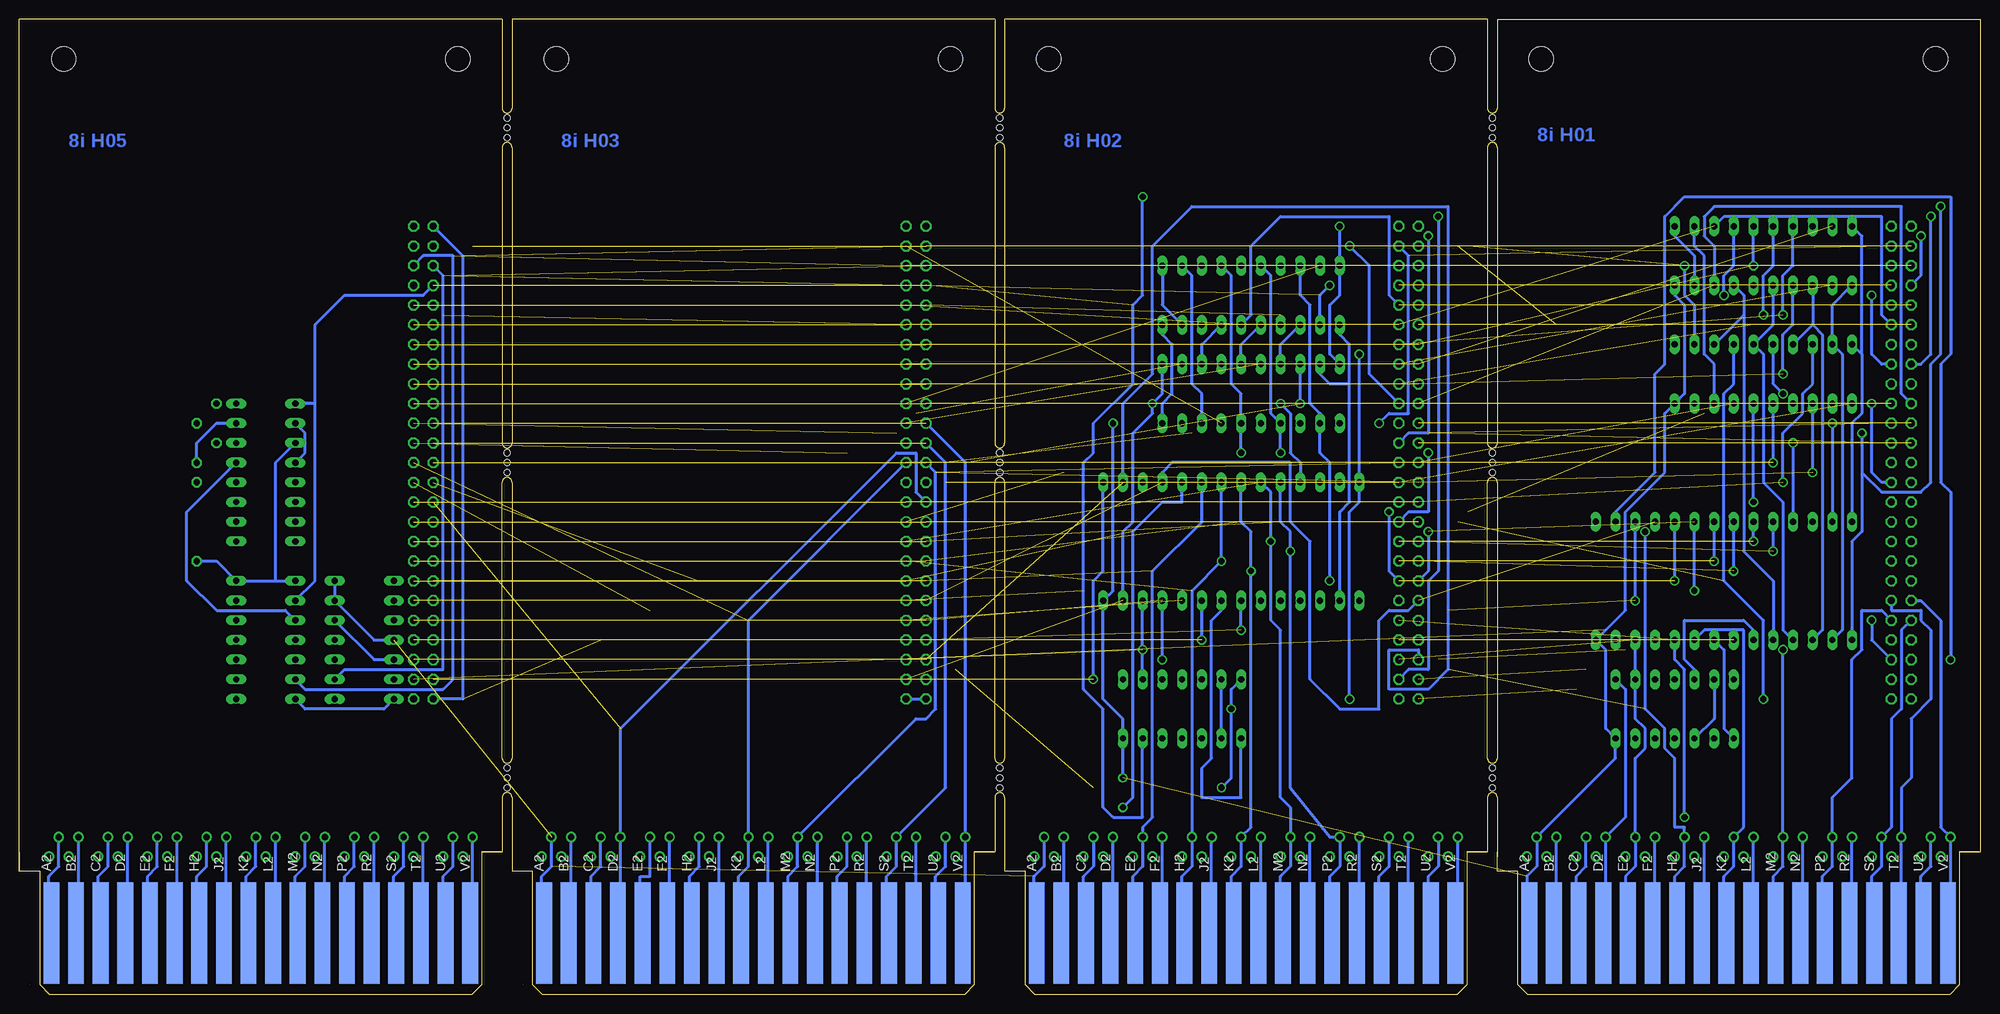
[diagram p6: board, bottom side, seen from below]

Size 252.73 x 125.73 mm. Coordinates in mm from the lower left corner, seen from the top.
Copper layers (1+16): Top 0.035mm / dielectric 1.5mm / Bottom 0.035mm
Design rules "16mils": minimum track width 16mil, minimum drill 32mil, track to track 15mil, track to pad 10mil, pad to pad 10mil, via to via 10mil, smd to smd 10mil, copper to edge 13mil, drill to drill 10mil, minimum pad ring 10mil, minimum via ring 8mil, stop-mask expansion 0mil, vias tented up to drill 0mil, thermal gap 10mil

### Footprints (pad centres in the part's own frame; a part is rotated, then mirrored left to right if it is on the bottom)
C050-025X075 = drill 0.813 octagon: 1 -2.54,0; 2 2.54,0
DECPROTO1111 = hole 3.175: 183.515,120.65; 132.715,120.65; 69.266,120.65; 120.066,120.65; 56.566,120.65; 5.766,120.65; 247.015,120.65; 196.215,120.65 | hole 0.813: 62.865,69.85; 62.865,68.58; 62.865,67.31; 62.865,26.67; 62.865,27.94; 62.865,29.21; 62.865,113.03; 62.865,110.49; 62.865,111.76; 126.365,69.85; 126.365,68.58; 126.365,67.31; 126.365,26.67; 126.365,27.94; 126.365,29.21; 126.365,113.03; 126.365,110.49; 126.365,111.76; 189.865,26.67; 189.865,27.94; 189.865,29.21; 189.865,67.31; 189.865,68.58; 189.865,69.85; 189.865,110.49; 189.865,111.76; 189.865,113.03
EDGE-CON2 = smd 13.106 x 2.032: A1 7.938,4.128; B1 7.938,7.303; C1 7.938,10.477; D1 7.938,13.652; E1 7.938,16.828; F1 7.938,20.003; H1 7.938,23.177; J1 7.938,26.352; K1 7.938,29.527; L1 7.938,32.703; M1 7.938,35.877; N1 7.938,39.053; P1 7.938,42.227; R1 7.938,45.403; S1 7.938,48.578; T1 7.938,51.752; U1 7.938,54.928; V1 7.938,58.102 | smd 13.106 x 2.032 bottom: A2 7.938,4.128; B2 7.938,7.303; C2 7.938,10.477; D2 7.938,13.652; E2 7.938,16.828; F2 7.938,20.003; H2 7.938,23.177; J2 7.938,26.352; K2 7.938,29.527; L2 7.938,32.703; M2 7.938,35.877; N2 7.938,39.053; P2 7.938,42.227; R2 7.938,45.403; S2 7.938,48.578; T2 7.938,51.752; U2 7.938,54.928; V2 7.938,58.102
DIL28-6 = drill 0.813 long: 1 -16.51,-7.62; 2 -13.97,-7.62; 3 -11.43,-7.62; 4 -8.89,-7.62; 5 -6.35,-7.62; 6 -3.81,-7.62; 7 -1.27,-7.62; 8 1.27,-7.62; 9 3.81,-7.62; 10 6.35,-7.62; 11 8.89,-7.62; 12 11.43,-7.62; 13 13.97,-7.62; 14 16.51,-7.62; 15 16.51,7.62; 16 13.97,7.62; 17 11.43,7.62; 18 8.89,7.62; 19 6.35,7.62; 20 3.81,7.62; 21 1.27,7.62; 22 -1.27,7.62; 23 -3.81,7.62; 24 -6.35,7.62; 25 -8.89,7.62; 26 -11.43,7.62; 27 -13.97,7.62; 28 -16.51,7.62
DIL14 = drill 0.813 long: 1 -7.62,-3.81; 2 -5.08,-3.81; 3 -2.54,-3.81; 4 0,-3.81; 5 2.54,-3.81; 6 5.08,-3.81; 7 7.62,-3.81; 8 7.62,3.81; 9 5.08,3.81; 10 2.54,3.81; 11 0,3.81; 12 -2.54,3.81; 13 -5.08,3.81; 14 -7.62,3.81
DIL20 = drill 0.813 long: 1 -11.43,-3.81; 2 -8.89,-3.81; 3 -6.35,-3.81; 4 -3.81,-3.81; 5 -1.27,-3.81; 6 1.27,-3.81; 7 3.81,-3.81; 8 6.35,-3.81; 9 8.89,-3.81; 10 11.43,-3.81; 11 11.43,3.81; 12 8.89,3.81; 13 6.35,3.81; 14 3.81,3.81; 15 1.27,3.81; 16 -1.27,3.81; 17 -3.81,3.81; 18 -6.35,3.81; 19 -8.89,3.81; 20 -11.43,3.81
DIL16 = drill 0.813 long: 1 -8.89,-3.81; 2 -6.35,-3.81; 3 -3.81,-3.81; 4 -1.27,-3.81; 5 1.27,-3.81; 6 3.81,-3.81; 7 6.35,-3.81; 8 8.89,-3.81; 9 8.89,3.81; 10 6.35,3.81; 11 3.81,3.81; 12 1.27,3.81; 13 -1.27,3.81; 14 -3.81,3.81; 15 -6.35,3.81; 16 -8.89,3.81
0309/10 = drill 0.813 octagon: 1 -5.08,0; 2 5.08,0
ML50L = drill 0.914 octagon: 1 -30.48,-1.27; 2 -30.48,1.27; 3 -27.94,-1.27; 4 -27.94,1.27; 5 -25.4,-1.27; 6 -25.4,1.27; 7 -22.86,-1.27; 8 -22.86,1.27; 9 -20.32,-1.27; 10 -20.32,1.27; 11 -17.78,-1.27; 12 -17.78,1.27; 13 -15.24,-1.27; 14 -15.24,1.27; 15 -12.7,-1.27; 16 -12.7,1.27; 17 -10.16,-1.27; 18 -10.16,1.27; 19 -7.62,-1.27; 20 -7.62,1.27; 21 -5.08,-1.27; 22 -5.08,1.27; 23 -2.54,-1.27; 24 -2.54,1.27; 25 0,-1.27; 26 0,1.27; 27 2.54,-1.27; 28 2.54,1.27; 29 5.08,-1.27; 30 5.08,1.27; 31 7.62,-1.27; 32 7.62,1.27; 33 10.16,-1.27; 34 10.16,1.27; 35 12.7,-1.27; 36 12.7,1.27; 37 15.24,-1.27; 38 15.24,1.27; 39 17.78,-1.27; 40 17.78,1.27; 41 20.32,-1.27; 42 20.32,1.27; 43 22.86,-1.27; 44 22.86,1.27; 45 25.4,-1.27; 46 25.4,1.27; 47 27.94,-1.27; 48 27.94,1.27; 49 30.48,-1.27; 50 30.48,1.27
THRU-HOLEB = drill 0.813 pad 1.27: A1 17.78,3.81; A2 20.32,5.08; B1 17.78,6.35; B2 20.32,7.62; C1 17.78,10.16; C2 20.32,11.43; D1 17.78,12.7; D2 20.32,13.97; E1 17.78,16.51; E2 20.32,17.78; F1 17.78,19.05; F2 20.32,20.32; H1 17.78,22.86; H2 20.32,24.13; J1 17.78,25.4; J2 20.32,26.67; K1 17.78,29.21; K2 20.32,30.48; L1 17.78,31.75; L2 20.32,33.02; M1 17.78,35.56; M2 20.32,36.83; N1 17.78,38.1; N2 20.32,39.37; P1 17.78,41.91; P2 20.32,43.18; R1 17.78,44.45; R2 20.32,45.72; S1 17.78,48.26; S2 20.32,49.53; T1 17.78,50.8; T2 20.32,52.07; U1 17.78,54.61; U2 20.32,55.88; V1 17.78,57.15; V2 20.32,58.42

### Placement (x,y rotation side)
C2  227.33,73.66 270 top
C4  229.87,71.12 90 top
E$1  [DECPROTO1111]  0,0 0 top
EDGE1  62.23,0 90 top
EDGE2  125.73,0 90 top
EDGE3  189.23,0 90 top
EDGE5  252.73,0 90 top
IC1  33.02,53.34 180 top
IC2  96.52,58.42 180 top
IC3  39.37,36.83 180 top
IC4  27.94,80.01 180 top
IC5  102.87,36.83 180 top
IC6  27.94,95.25 180 top
IC7  93.98,90.17 180 top
IC8  93.98,77.47 180 top
IC9  220.98,45.72 270 top
IC10  208.28,45.72 270 top
IC11  220.98,67.31 270 top
R1  229.87,60.96 90 top
SV1  73.66,68.58 90 top
SV2  10.16,68.58 90 top
SV3  137.16,68.58 90 top
SV4  200.66,68.58 90 top
U$1  62.23,0 90 top
U$2  125.73,0 90 top
U$3  189.23,0 90 top
U$5  252.73,0 90 top

### Tracks (layer width: path | path; a pad name or v marks a point on that pad's centre or on a via)
500NS
  Top 0.406: IC9.3 214.63,45.72 IC10.11 209.55,48.26 IC10.3
  Bottom 0.406: IC11.13 231.14,62.23 231.14,53.34 227.33,49.53 218.44,49.53 IC9.3
BMA00(1)  (via drill 0.81)  (3 unrouted)
  Top 0.406: IC1.23 35.56,46.99 12.7,46.99 SV2.7 | v100.33,45.72 SV1.7
  Bottom 0.406: EDGE1.K2 33.02,8.89 33.02,15.24 31.75,16.51 U$1.K2 30.48,21.59 30.48,46.99 35.56,46.99 IC1.23 | v100.33,45.72 IC2.23
BMA01(1)  (via drill 0.81)  (3 unrouted)
  Top 0.406: SV2.8 10.16,44.45 v25.4,44.45 30.48,44.45 IC1.21 | v95.25,46.99 73.66,46.99 SV1.8
  Bottom 0.406: EDGE1.M2 26.67,8.89 26.67,15.24 25.4,16.51 U$1.M2 v25.4,44.45 | v95.25,46.99 IC2.21
BMA02(1)  (via drill 0.81)  (3 unrouted)
  Top 0.406: v38.1,22.86 21.59,22.86 U$1.P2 | SV1.9 86.36,48.26 86.36,53.34 101.6,53.34 102.87,52.07 IC2.24
  Bottom 0.406: EDGE1.P2 20.32,8.89 20.32,15.24 19.05,16.51 U$1.P2 19.05,25.4 16.51,27.94 16.51,43.18 15.24,44.45 15.24,49.53 12.7,49.53 SV2.9 | IC1.24 39.37,43.18 38.1,41.91 v38.1,22.86
BMA03(1)  (via drill 0.81)  (3 unrouted)
  Top 0.406: IC1.25 43.18,44.45 45.72,44.45 45.72,49.53 10.16,49.53 SV2.10 | v105.41,43.18 78.74,43.18 77.47,41.91 71.12,41.91 69.85,43.18 69.85,48.26 SV1.10
  Bottom 0.406: EDGE1.S2 13.97,8.89 13.97,15.24 12.7,16.51 U$1.S2 11.43,21.59 11.43,35.56 10.16,36.83 10.16,46.99 SV2.10 | v105.41,43.18 IC2.25
BMA04(1)  (via drill 0.81)  (3 unrouted)
  Top 0.406: SV2.11 v44.45,50.8 | SV1.11 73.66,49.53 68.58,49.53 68.58,39.37 72.39,35.56 109.22,35.56 113.03,39.37 115.57,39.37 115.57,52.07 107.95,59.69 IC2.3
  Bottom 0.406: EDGE1.T2 10.16,8.89 U$1.T2 10.16,26.67 8.89,27.94 8.89,35.56 6.35,38.1 6.35,46.99 7.62,48.26 7.62,49.53 11.43,49.53 SV2.11 | v44.45,50.8 IC1.3
BMA05(1)  (3 unrouted)
  Top 0.406: IC1.4 40.64,59.69 7.62,59.69 7.62,50.8 SV2.12
  Bottom 0.406: EDGE1.V2 3.81,8.89 U$1.V2 5.08,21.59 5.08,48.26 7.62,50.8 SV2.12 | SV1.12 73.66,49.53 76.2,49.53 77.47,48.26 77.47,36.83 82.55,36.83 86.36,40.64 86.36,58.42 88.9,60.96 88.9,68.58 104.14,68.58 105.41,67.31 IC2.4
BMA06(1)  (via drill 0.81)  (3 unrouted)
  Top 0.406: SV2.13 v39.37,53.34 | v76.2,62.23 100.33,62.23 102.87,64.77 IC2.5 | v110.49,24.13 111.76,22.86 U$2.D2
  Bottom 0.406: v39.37,53.34 IC1.5 | v110.49,24.13 109.22,25.4 109.22,59.69 105.41,63.5 102.87,63.5 IC2.5 | SV1.13 76.2,54.61 v76.2,62.23 | EDGE2.D2 111.76,8.26 U$2.D2
BMA07(1)  (via drill 0.81)  (3 unrouted)
  Top 0.406: v36.83,52.07 10.16,52.07 SV2.14 | v71.12,59.69 91.44,59.69 92.71,60.96 100.33,60.96 104.14,64.77 104.14,67.31 101.6,67.31 IC2.6
  Bottom 0.406: v36.83,52.07 IC1.6 | IC2.6 100.33,60.96 106.68,54.61 106.68,22.86 107.95,21.59 U$2.E2 107.95,16.51 109.22,15.24 109.22,8.26 EDGE2.E2 | SV1.14 71.12,54.61 v71.12,59.69
BMA08(1)  (via drill 0.81)  (3 unrouted)
  Top 0.406: SV2.15 v34.29,55.88 | v97.79,55.88 SV1.15
  Bottom 0.406: v34.29,55.88 IC1.7 | IC2.7 v97.79,55.88 101.6,52.07 U$2.H2 101.6,16.51 102.87,15.24 102.87,8.26 EDGE2.H2
BMA09(1)  (via drill 0.81)  (3 unrouted)
  Top 0.406: v31.75,54.61 10.16,54.61 SV2.16 | SV1.16 73.66,54.61 v93.98,54.61
  Bottom 0.406: v31.75,54.61 IC1.8 | IC2.8 95.25,60.96 93.98,59.69 v93.98,54.61 93.98,21.59 U$2.K2 95.25,16.51 96.52,15.24 96.52,8.26 EDGE2.K2
BMA10(1)  (via drill 0.81)  (3 unrouted)
  Top 0.406: SV2.17 v29.21,58.42 | v91.44,58.42 SV1.17
  Bottom 0.406: v29.21,58.42 IC1.9 | IC2.9 91.44,64.77 v91.44,58.42 91.44,48.26 90.17,46.99 90.17,25.4 88.9,24.13 U$2.M2 88.9,16.51 90.17,15.24 90.17,8.26 EDGE2.M2
BMA11(1)  (via drill 0.81)  (3 unrouted)
  Top 0.406: v26.67,57.15 10.16,57.15 SV2.18 | SV1.18 73.66,57.15 v88.9,57.15
  Bottom 0.406: v26.67,57.15 IC1.10 | IC2.10 90.17,60.96 88.9,59.69 v88.9,57.15 88.9,26.67 83.82,20.32 U$2.P2 82.55,16.51 83.82,15.24 83.82,8.26 EDGE2.P2
BTP2  (3 unrouted)
  Top 0.406: SV4.48 194.31,96.52 U$5.V2
  Bottom 0.406: U$5.V2 194.31,8.89 EDGE5.V2
CS(0)1
  Top 0.406: IC3.3 IC3.4 IC3.5
  Bottom 0.406: IC1.20 29.21,46.99 30.48,48.26 38.1,48.26 38.1,43.18 36.83,41.91 IC3.5
CS(0)2
  Top 0.406: IC5.5 IC5.4 IC5.3 107.95,43.18 109.22,43.18 109.22,45.72 107.95,46.99 99.06,46.99 97.79,48.26 93.98,48.26 92.71,49.53 IC2.20
CS(1)
  Bottom 0.406: IC3.10 34.29,35.56 IC3.6
CS(1)2
  Bottom 0.406: IC5.9 IC5.6
D0  (via drill 0.81)
  Top 0.406: v24.13,71.12 24.13,72.39 25.4,73.66 33.02,73.66 34.29,74.93 IC4.18
  Bottom 0.406: v24.13,71.12 IC1.11 | IC6.2 36.83,96.52 35.56,95.25 35.56,82.55 34.29,81.28 IC4.18
D1  (via drill 0.81)
  Top 0.406: 26.67,63.5 24.13,63.5 22.86,62.23 22.86,60.96 IC1.12 | 26.67,63.5 v29.21,63.5 | v33.02,90.17 36.83,86.36 39.37,86.36 41.91,83.82 41.91,73.66 35.56,73.66 34.29,72.39 34.29,68.58 33.02,67.31 30.48,67.31 26.67,63.5
  Bottom 0.406: v29.21,63.5 IC4.16 | IC6.4 31.75,93.98 33.02,92.71 v33.02,90.17
D2  (via drill 0.81)
  Top 0.406: v19.05,73.66 22.86,73.66 24.13,74.93 IC4.14 22.86,77.47 7.62,77.47 7.62,82.55 12.7,82.55 15.24,85.09 25.4,85.09 v27.94,87.63
  Bottom 0.406: v19.05,73.66 IC1.13 | IC6.6 26.67,93.98 27.94,92.71 v27.94,87.63
D3  (via drill 0.81)
  Top 0.406: v15.24,72.39 17.78,74.93 17.78,76.2 IC4.12 | IC6.8 19.05,101.6 v5.08,101.6
  Bottom 0.406: IC1.15 16.51,58.42 15.24,59.69 15.24,67.31 | v15.24,72.39 15.24,67.31 | v5.08,101.6 5.08,82.55 6.35,81.28 6.35,66.04 7.62,64.77 12.7,64.77 15.24,67.31
D4
  Bottom 0.406: IC1.16 17.78,46.99 17.78,82.55 IC4.9 19.05,88.9 IC6.11
D5
  Bottom 0.406: 21.59,86.36 IC4.7 | IC6.13 21.59,86.36 | IC1.17 20.32,46.99 20.32,85.09 21.59,86.36
D6
  Bottom 0.406: IC1.18 25.4,46.99 25.4,63.5 27.94,66.04 27.94,82.55 IC4.5 26.67,86.36 IC6.15
D7
  Bottom 0.406: IC1.19 26.67,53.34 30.48,57.15 30.48,87.63 | 30.48,87.63 30.48,90.17 IC6.17 | 30.48,87.63 IC4.3
D8  (via drill 0.81)
  Top 0.406: v90.17,76.2 97.79,76.2 IC8.18
  Bottom 0.406: IC7.2 101.6,92.71 101.6,78.74 100.33,77.47 IC8.18 | v90.17,76.2 88.9,74.93 88.9,69.85 87.63,68.58 IC2.11
D9  (via drill 0.81)
  Top 0.406: v95.25,69.85 92.71,69.85 91.44,68.58 87.63,68.58 IC2.12
  Bottom 0.406: v95.25,69.85 IC8.16 95.25,77.47 96.52,78.74 96.52,92.71 IC7.4
D10  (via drill 0.81)
  Top 0.406: v90.17,69.85 86.36,69.85 IC2.13
  Bottom 0.406: v90.17,69.85 IC8.14 91.44,74.93 91.44,92.71 IC7.6
D11  (via drill 0.81)
  Top 0.406: v83.82,53.34 81.28,53.34 80.01,52.07 IC2.15
  Bottom 0.406: v83.82,53.34 83.82,68.58 85.09,69.85 IC8.12 85.09,74.93 86.36,76.2 86.36,88.9 87.63,90.17 IC7.8
EA0(1)  (via drill 0.81)  (3 unrouted)
  Top 0.406: IC1.1 49.53,48.26 50.8,46.99 50.8,41.91 46.99,41.91 | IC3.1 46.99,41.91 | SV2.4 10.16,39.37 12.7,39.37 15.24,41.91 46.99,41.91 | SV1.4 73.66,39.37 76.2,39.37 77.47,40.64 91.44,40.64 93.98,38.1 107.95,38.1 IC5.1 v114.3,40.64
  Bottom 0.406: EDGE1.D2 48.26,8.89 U$1.D2 45.72,22.86 45.72,39.37 IC3.1 | v114.3,40.64 114.3,53.34 113.03,54.61 IC2.1
EA1(1)  (via drill 0.81)  (3 unrouted)
  Top 0.406: v13.97,48.26 43.18,48.26 44.45,46.99 IC1.26 | SV1.5 76.2,44.45 v107.95,44.45
  Bottom 0.406: IC1.26 IC3.2 44.45,35.56 43.18,34.29 43.18,31.75 44.45,30.48 U$1.E2 44.45,16.51 45.72,15.24 45.72,8.89 EDGE1.E2 | SV2.5 13.97,45.72 v13.97,48.26 | IC2.26 v107.95,44.45 IC5.2
EA2(1)  (via drill 0.81)  (3 unrouted)
  Top 0.406: IC1.2 45.72,59.69 v43.18,59.69 | v3.81,43.18 SV2.6
  Bottom 0.406: EDGE1.H2 39.37,8.89 39.37,15.24 38.1,16.51 U$1.H2 38.1,21.59 39.37,21.59 39.37,30.48 40.64,31.75 40.64,34.29 43.18,36.83 v43.18,59.69 | v3.81,43.18 3.81,64.77 5.08,66.04 5.08,81.28 3.81,82.55 3.81,102.87 38.1,102.87 40.64,100.33 40.64,81.28 41.91,80.01 41.91,67.31 46.99,62.23 IC1.2 | SV1.6 72.39,44.45 76.2,44.45 76.2,39.37 71.12,39.37 68.58,41.91 68.58,101.6 101.6,101.6 106.68,96.52 106.68,80.01 110.49,76.2 IC2.2
GND  (via drill 0.81)  (3 unrouted)
  Top 0.406: IC6.10 SV2.49 SV2.50 6.35,99.06 6.35,95.25 13.97,95.25 15.24,96.52 24.13,96.52 25.4,97.79 25.4,100.33 38.1,100.33 38.1,96.52 52.07,82.55 52.07,39.37 30.48,39.37 | 30.48,39.37 IC3.7 | 30.48,39.37 13.97,39.37 12.7,38.1 SV2.1 SV2.2 | 30.48,39.37 30.48,24.13 46.99,24.13 U$1.C2 | SV1.50 SV1.49 v82.55,99.06 | v80.01,82.55 81.28,82.55 IC8.10 | SV1.2 SV1.1 v81.28,38.1 92.71,38.1 93.98,36.83 v96.52,36.83 | v97.79,26.67 114.3,26.67 U$2.C2 | IC10.7 SV4.1 SV4.2 | SV4.50 SV4.49 214.63,86.36 214.63,60.96 IC11.8 218.44,59.69 227.33,59.69 | 227.33,59.69 C2.2 | 227.33,59.69 227.33,55.88 241.3,41.91 U$5.C2 | SV3.49 SV3.50 132.08,95.25 132.08,82.55 | SV3.2 132.08,41.91 132.08,82.55 | U$3.C2 177.8,45.72 140.97,82.55 132.08,82.55
  Bottom 0.406: IC1.14 16.51,73.66 15.24,74.93 15.24,82.55 | IC4.10 15.24,82.55 | IC6.10 15.24,97.79 15.24,82.55 | U$1.C2 50.8,16.51 52.07,15.24 52.07,8.89 EDGE1.C2 | IC8.10 83.82,82.55 83.82,88.9 82.55,90.17 IC7.10 v82.55,99.06 | v80.01,82.55 IC2.14 80.01,63.5 81.28,62.23 v81.28,38.1 | v97.79,26.67 96.52,27.94 v96.52,36.83 96.52,39.37 IC5.7 | U$2.C2 114.3,16.51 115.57,15.24 115.57,8.26 EDGE2.C2 | IC9.7 215.9,36.83 205.74,36.83 IC10.7 | SV4.2 195.58,38.1 195.58,95.25 SV4.50 | U$5.C2 241.3,16.51 242.57,15.24 242.57,8.89 EDGE5.C2 | U$3.C2 177.8,16.51 179.07,15.24 179.07,8.89 EDGE3.C2 | SV3.1 SV3.2
MBODD_P  (via drill 0.81)  (3 unrouted)
  Top 0.406: U$5.T2 195.58,25.4 195.58,95.25 200.66,95.25 SV4.47 | 92.71,72.39 96.52,72.39 IC8.17 | 92.71,72.39 IC8.15 | 92.71,72.39 87.63,72.39 | 87.63,72.39 IC8.13 | 87.63,72.39 83.82,72.39 IC8.11 v77.47,73.66
  Bottom 0.406: U$5.T2 200.66,8.89 EDGE5.T2 | SV1.47 73.66,95.25 73.66,74.93 76.2,74.93 v77.47,73.66
MCBMB00(0)  (via drill 0.81)  (3 unrouted)
  Top 0.406: v38.1,93.98 34.29,97.79 27.94,97.79 25.4,95.25 15.24,95.25 12.7,92.71 7.62,92.71 1.27,86.36 1.27,62.23 10.16,62.23 SV2.19 | v71.12,69.85 71.12,71.12 69.85,72.39 69.85,92.71 66.04,96.52 66.04,102.87 67.31,104.14 109.22,104.14 114.3,99.06 114.3,71.12 118.11,67.31 118.11,40.64 113.03,35.56 113.03,29.21 85.09,29.21 U$2.S2
  Bottom 0.406: IC4.2 36.83,88.9 38.1,90.17 v38.1,93.98 | SV1.19 73.66,62.23 71.12,62.23 v71.12,69.85 | U$2.S2 76.2,16.51 77.47,15.24 77.47,8.26 EDGE2.S2
MCBMB01(0)  (via drill 0.81)  (3 unrouted)
  Top 0.406: v27.94,38.1 13.97,38.1 12.7,36.83 7.62,36.83 1.27,43.18 1.27,60.96 SV2.20 | SV1.20 67.31,60.96 67.31,39.37 73.66,33.02 U$2.T2
  Bottom 0.406: IC4.4 31.75,78.74 33.02,77.47 33.02,53.34 27.94,48.26 v27.94,38.1 | EDGE2.T2 73.66,8.26 U$2.T2
MCBMB02(0)  (via drill 0.81)  (3 unrouted)
  Top 0.406: v25.4,77.47 35.56,77.47 35.56,74.93 33.02,72.39 33.02,68.58 30.48,68.58 26.67,64.77 13.97,64.77 12.7,63.5 SV2.21 | SV1.21 73.66,62.23 66.04,62.23 66.04,21.59 U$2.V2
  Bottom 0.406: IC4.6 26.67,78.74 v25.4,77.47 | EDGE2.V2 67.31,8.26 U$2.V2
MCBMB03(0)  (via drill 0.81)  (3 unrouted)
  Top 0.406: v25.4,66.04 13.97,66.04 12.7,64.77 8.89,64.77 SV2.22
  Bottom 0.406: IC4.8 21.59,78.74 22.86,77.47 22.86,74.93 25.4,72.39 v25.4,66.04 | EDGE3.D2 175.26,8.89 U$3.D2 175.26,34.29 139.7,69.85 137.16,69.85 137.16,64.77 SV3.22
MCBMB04(0)  (via drill 0.81)  (3 unrouted)
  Top 0.406: v13.97,76.2 IC4.11 | U$3.E2 171.45,49.53 140.97,80.01 134.62,80.01 133.35,78.74 133.35,66.04 134.62,64.77 137.16,64.77 SV3.23
  Bottom 0.406: v13.97,76.2 13.97,67.31 12.7,66.04 SV2.23 | U$3.E2 171.45,15.24 172.72,15.24 172.72,8.89 EDGE3.E2
MCBMB05(0)  (via drill 0.81)  (3 unrouted)
  Top 0.406: v21.59,67.31 10.16,67.31 SV2.24 | SV3.24 134.62,67.31 134.62,77.47 140.97,77.47 165.1,53.34 U$3.H2
  Bottom 0.406: v21.59,67.31 IC4.13 | U$3.H2 165.1,16.51 166.37,15.24 166.37,8.89 EDGE3.H2
MCBMB06(0)  (via drill 0.81)  (3 unrouted)
  Top 0.406: SV2.25 v26.67,68.58
  Bottom 0.406: v26.67,68.58 IC4.15 | EDGE3.K2 160.02,8.89 160.02,15.24 158.75,16.51 U$3.K2 158.75,48.26 SV3.25
MCBMB07(0)  (3 unrouted)
  Top 0.406: IC4.17 30.48,74.93 25.4,74.93 20.32,69.85 10.16,69.85 SV2.26
  Bottom 0.406: EDGE3.M2 153.67,8.89 153.67,15.24 152.4,16.51 U$3.M2 137.16,35.56 135.89,35.56 134.62,36.83 134.62,67.31 SV3.26
MCBMB08(0)  (via drill 0.81)  (3 unrouted)
  Top 0.406: IC8.2 101.6,82.55 101.6,87.63 96.52,87.63 93.98,90.17 90.17,90.17 88.9,91.44 86.36,91.44 86.36,95.25 83.82,97.79 v71.12,97.79 | SV3.27 137.16,72.39 137.16,74.93 140.97,74.93 146.05,69.85 U$3.P2
  Bottom 0.406: v71.12,97.79 71.12,72.39 73.66,72.39 SV1.27 | U$3.P2 146.05,16.51 147.32,15.24 147.32,8.89 EDGE3.P2
MCBMB09(0)  (3 unrouted)
  Top 0.406: SV1.28 73.66,69.85 76.2,69.85 76.2,66.04 78.74,63.5 96.52,63.5 96.52,67.31 101.6,72.39 101.6,76.2 97.79,80.01 IC8.4
  Bottom 0.406: EDGE3.S2 140.97,8.89 140.97,15.24 139.7,16.51 U$3.S2 133.35,26.67 133.35,68.58 SV3.28
MCBMB10(0)  (3 unrouted)
  Top 0.406: IC8.6 88.9,77.47 71.12,77.47 71.12,72.39 73.66,72.39 SV1.29 | SV3.29 139.7,72.39 139.7,22.86 U$3.T2
  Bottom 0.406: U$3.T2 137.16,8.89 EDGE3.T2
MCBMB11(0)  (via drill 0.81)  (3 unrouted)
  Top 0.406: v87.63,76.2 81.28,76.2 80.01,74.93 73.66,74.93 73.66,73.66 SV1.30
  Bottom 0.406: v87.63,76.2 IC8.8 | EDGE3.V2 130.81,8.89 U$3.V2 130.81,68.58 SV3.30
MEM00  (3 unrouted)
  Bottom 0.406: IC6.18 34.29,96.52 35.56,97.79 35.56,100.33 34.29,101.6 10.16,101.6 10.16,77.47 SV2.32
MEM01  (3 unrouted)
  Top 0.406: IC6.16 29.21,86.36 27.94,85.09 27.94,78.74 SV2.33
MEM02  (via drill 0.81)  (3 unrouted)
  Top 0.406: v25.4,80.01 10.16,80.01 SV2.34
  Bottom 0.406: IC6.14 24.13,86.36 25.4,85.09 v25.4,80.01
MEM03  (via drill 0.81)  (3 unrouted)
  Top 0.406: IC6.12 17.78,90.17 v13.97,90.17
  Bottom 0.406: v13.97,90.17 13.97,82.55 12.7,81.28 SV2.35
MEM04  (via drill 0.81)  (3 unrouted)
  Top 0.406: IC6.9 17.78,100.33 v6.35,100.33
  Bottom 0.406: v6.35,100.33 6.35,82.55 7.62,81.28 SV2.36
MEM05  (via drill 0.81)  (3 unrouted)
  Top 0.406: v25.4,87.63 24.13,86.36 15.24,86.36 12.7,83.82 SV2.37
  Bottom 0.406: IC6.7 24.13,93.98 25.4,92.71 v25.4,87.63
MEM06  (via drill 0.81)  (3 unrouted)
  Top 0.406: v29.21,93.98 27.94,92.71 27.94,90.17 25.4,90.17 22.86,87.63 15.24,87.63 12.7,85.09 10.16,85.09 SV2.38
  Bottom 0.406: v29.21,93.98 IC6.5
MEM07  (3 unrouted)
  Bottom 0.406: IC6.3 33.02,100.33 12.7,100.33 12.7,87.63 SV2.39
MEM08  (3 unrouted)
  Top 0.406: SV4.40 198.12,87.63 198.12,90.17 205.74,90.17 205.74,67.31 215.9,57.15 224.79,57.15 238.76,43.18 U$5.D2 | IC7.18 99.06,85.09 73.66,85.09 SV1.40
  Bottom 0.406: U$5.D2 238.76,8.89 EDGE5.D2
MEM09  (3 unrouted)
  Top 0.406: SV4.41 204.47,88.9 204.47,66.04 214.63,55.88 218.44,55.88 222.25,52.07 227.33,52.07 234.95,44.45 U$5.E2
  Bottom 0.406: U$5.E2 234.95,16.51 236.22,15.24 236.22,8.89 EDGE5.E2 | IC7.16 93.98,87.63 93.98,96.52 90.17,100.33 76.2,100.33 76.2,90.17 SV1.41
MEM10  (3 unrouted)
  Top 0.406: SV4.42 200.66,87.63 203.2,87.63 203.2,64.77 213.36,54.61 218.44,54.61 223.52,49.53 228.6,49.53 U$5.H2 | SV1.42 73.66,90.17 87.63,90.17 90.17,87.63 IC7.14
  Bottom 0.406: U$5.H2 228.6,16.51 229.87,15.24 229.87,8.89 EDGE5.H2
MEM11  (via drill 0.81)  (3 unrouted)
  Top 0.406: SV4.43 200.66,92.71 196.85,92.71 196.85,53.34 198.12,52.07 218.44,52.07 222.25,48.26 U$5.K2 | v83.82,91.44 SV1.43
  Bottom 0.406: U$5.K2 222.25,16.51 223.52,15.24 223.52,8.89 EDGE5.K2 | v83.82,91.44 85.09,90.17 IC7.12
MEM_P  (via drill 0.81)  (3 unrouted)
  Top 0.406: v81.28,96.52 83.82,96.52 85.09,95.25 IC7.9
  Bottom 0.406: v81.28,96.52 78.74,93.98 78.74,80.01 SV1.31
MEMDONE(1)  (3 unrouted)
  Top 0.406: IC10.9 203.2,31.75 U$5.S2
  Bottom 0.406: SV4.46 198.12,92.71 198.12,41.91 210.82,41.91 IC10.9 | U$5.S2 203.2,16.51 204.47,15.24 204.47,8.89 EDGE5.S2
MEMSTART(0)  (via drill 0.81)  (3 unrouted)
  Top 0.406: IC3.12 IC3.13 45.72,34.29 54.61,34.29 54.61,86.36 39.37,101.6 22.86,101.6 22.86,97.79 v7.62,97.79 | U$5.M2 219.71,24.13 219.71,48.26 IC9.2 | IC5.13 IC5.12 | SV1.44 67.31,96.52 67.31,102.87 v107.95,102.87
  Bottom 0.406: SV2.44 7.62,92.71 v7.62,97.79 | 214.63,76.2 214.63,53.34 IC9.2 | 214.63,76.2 IC11.1 | SV4.44 200.66,90.17 210.82,90.17 214.63,86.36 214.63,76.2 | U$5.M2 215.9,16.51 217.17,15.24 217.17,8.89 EDGE5.M2 | v107.95,102.87 107.95,90.17 109.22,88.9 109.22,78.74 114.3,73.66 114.3,69.85 115.57,68.58 115.57,39.37 113.03,36.83 113.03,24.13 111.76,22.86 107.95,22.86 IC5.13
MEMSTART(1)
  Top 0.406: IC3.11 38.1,31.75 35.56,31.75 IC3.9
MEMSTART(1)2
  Top 0.406: IC5.11 IC5.10
N$1
  Bottom 0.406: U$1.L2 29.21,8.89 EDGE1.L2
N$2
  Bottom 0.406: IC7.13 90.17,83.82 IC8.7
N$3
  Bottom 0.406: U$1.N2 22.86,8.89 EDGE1.N2
N$4
  Bottom 0.406: IC7.15 95.25,83.82 IC8.5
N$5
  Bottom 0.406: U$1.R2 16.51,8.89 EDGE1.R2
N$6
  Bottom 0.406: IC7.17 100.33,83.82 IC8.3
N$7
  Bottom 0.406: EDGE2.L2 92.71,8.26 U$2.L2
N$8
  Bottom 0.406: EDGE2.N2 86.36,8.26 U$2.N2
N$9
  Bottom 0.406: U$1.J2 35.56,8.89 EDGE1.J2
N$10
  Bottom 0.406: EDGE2.R2 80.01,8.26 U$2.R2
N$11
  Bottom 0.406: U$1.F2 41.91,8.89 EDGE1.F2
N$12
  Bottom 0.406: EDGE2.J2 99.06,8.26 U$2.J2
N$13
  Bottom 0.406: EDGE2.F2 105.41,8.26 U$2.F2
N$14
  Bottom 0.406: U$2.U2 69.85,16.51 71.12,15.24 71.12,8.26 EDGE2.U2
N$15
  Bottom 0.406: U$1.U2 6.35,16.51 7.62,15.24 7.62,8.89 EDGE1.U2
N$16
  Bottom 0.406: EDGE2.B2 118.11,8.26 U$2.B2
N$17
  Bottom 0.406: U$1.B2 54.61,8.89 EDGE1.B2
N$18
  Top 0.406: U$2.K1 96.2,17.46 EDGE2.K1
N$19
  Top 0.406: U$1.K1 33.02,8.89 EDGE1.K1
N$20
  Top 0.406: U$1.L1 30.48,16.51 29.21,15.24 29.21,8.89 EDGE1.L1
N$21
  Top 0.406: U$1.M1 26.67,8.89 EDGE1.M1
N$22
  Top 0.406: U$1.N1 24.13,16.51 22.86,15.24 22.86,8.89 EDGE1.N1
N$23
  Top 0.406: U$1.P1 20.32,8.89 EDGE1.P1
N$24
  Top 0.406: U$1.R1 17.78,16.51 16.51,15.24 16.51,8.89 EDGE1.R1
N$25
  Top 0.406: U$1.S1 13.97,8.89 EDGE1.S1
N$26
  Top 0.406: U$1.T1 11.43,16.51 10.16,15.24 10.16,8.89 EDGE1.T1
N$27
  Top 0.406: U$1.U1 7.62,8.89 EDGE1.U1
N$28
  Top 0.406: U$1.V1 5.08,16.51 3.81,15.24 3.81,8.89 EDGE1.V1
N$29
  Top 0.406: U$1.J1 36.83,16.51 35.56,15.24 35.56,8.89 EDGE1.J1
N$30
  Top 0.406: U$1.H1 39.37,8.89 EDGE1.H1
N$31
  Top 0.406: U$1.F1 43.18,16.51 41.91,15.24 41.91,8.89 EDGE1.F1
N$32
  Top 0.406: U$1.E1 45.72,8.89 EDGE1.E1
N$33
  Top 0.406: U$1.D1 49.53,16.51 48.26,15.24 48.26,8.89 EDGE1.D1
N$34
  Top 0.406: U$1.C1 52.07,8.89 EDGE1.C1
N$35
  Top 0.406: U$1.B1 55.88,16.51 54.61,15.24 54.61,8.89 EDGE1.B1
N$36
  Top 0.406: U$1.A1 58.42,8.89 EDGE1.A1
N$37
  Top 0.406: U$2.L1 93.03,16.83 EDGE2.L1
N$38
  Top 0.406: U$2.M1 89.85,17.46 EDGE2.M1
N$39
  Top 0.406: U$2.N1 86.68,16.83 EDGE2.N1
N$40
  Top 0.406: U$2.P1 83.5,17.46 EDGE2.P1
N$41
  Top 0.406: U$2.R1 80.33,16.83 EDGE2.R1
N$42
  Top 0.406: U$2.S1 77.15,17.46 EDGE2.S1
N$43
  Top 0.406: U$2.T1 73.98,16.83 EDGE2.T1
N$47
  Top 0.406: U$2.U1 70.8,17.46 EDGE2.U1
N$48
  Top 0.406: U$2.V1 67.63,16.83 EDGE2.V1
N$49
  Top 0.406: U$2.J1 99.38,16.83 EDGE2.J1
N$50
  Top 0.406: U$2.H1 102.55,17.46 EDGE2.H1
N$51
  Top 0.406: U$2.F1 105.73,16.83 EDGE2.F1
N$52
  Top 0.406: U$2.E1 108.9,17.46 EDGE2.E1
N$53
  Top 0.406: U$2.D1 112.08,16.83 EDGE2.D1
N$54
  Top 0.406: U$2.C1 115.25,17.46 EDGE2.C1
N$55
  Top 0.406: U$2.B1 118.43,16.83 EDGE2.B1
N$56
  Top 0.406: U$2.A1 121.92,7.94 EDGE2.A1
N$57
  Bottom 0.406: U$3.J2 162.56,8.89 EDGE3.J2
N$58
  Bottom 0.406: U$3.L2 156.21,8.89 EDGE3.L2
N$59
  Bottom 0.406: U$3.N2 149.86,8.89 EDGE3.N2
N$60
  Bottom 0.406: U$3.F2 168.91,8.89 EDGE3.F2
N$61
  Bottom 0.406: U$3.R2 143.51,8.89 EDGE3.R2
N$62
  Bottom 0.406: U$3.B2 181.61,8.89 EDGE3.B2
N$63
  Bottom 0.406: U$3.U2 133.35,16.51 134.62,15.24 134.62,8.89 EDGE3.U2
N$64
  Top 0.406: U$3.A1 185.42,8.89 EDGE3.A1
N$65
  Top 0.406: U$3.V1 130.81,16.51 130.81,8.89 EDGE3.V1
N$66
  Top 0.406: U$3.U1 134.62,8.89 EDGE3.U1
N$67
  Top 0.406: U$3.T1 137.16,16.51 137.16,8.89 EDGE3.T1
N$68
  Top 0.406: U$3.S1 140.97,8.89 EDGE3.S1
N$69
  Top 0.406: U$3.R1 143.51,16.51 143.51,8.89 EDGE3.R1
N$70
  Top 0.406: U$3.P1 147.32,8.89 EDGE3.P1
N$71
  Top 0.406: U$3.N1 149.86,16.51 149.86,8.89 EDGE3.N1
N$72
  Top 0.406: U$3.M1 153.67,8.89 EDGE3.M1
N$73
  Top 0.406: U$3.L1 156.21,16.51 156.21,8.89 EDGE3.L1
N$74
  Top 0.406: U$3.K1 160.02,8.89 EDGE3.K1
N$75
  Top 0.406: U$3.J1 162.56,16.51 162.56,8.89 EDGE3.J1
N$76
  Top 0.406: U$3.H1 166.37,8.89 EDGE3.H1
N$77
  Top 0.406: U$3.F1 168.91,16.51 168.91,8.89 EDGE3.F1
N$78
  Top 0.406: U$3.E1 172.72,8.89 EDGE3.E1
N$79
  Top 0.406: U$3.D1 175.26,16.51 175.26,8.89 EDGE3.D1
N$80
  Top 0.406: U$3.C1 179.07,8.89 EDGE3.C1
N$81
  Top 0.406: U$3.B1 181.61,16.51 181.61,8.89 EDGE3.B1
N$82
  Top 0.406: IC9.5 215.9,41.91 209.55,41.91 207.01,44.45 203.2,44.45 203.2,49.53 IC10.2
N$83
  Bottom 0.406: IC10.12 207.01,43.18 IC10.5
N$84
  Bottom 0.406: IC11.4 215.9,69.85 215.9,72.39 IC11.2
N$85
  Top 0.406: C4.2 227.33,73.66 IC11.14
N$86
  Top 0.406: R1.2 C4.1
  Bottom 0.406: C4.1 229.87,71.12 227.33,73.66 IC11.15
N$87
  Bottom 0.406: U$5.J2 226.06,8.89 EDGE5.J2
N$88
  Bottom 0.406: U$5.L2 219.71,8.89 EDGE5.L2
N$89
  Bottom 0.406: U$5.N2 213.36,8.89 EDGE5.N2
N$90
  Bottom 0.406: U$5.F2 232.41,8.89 EDGE5.F2
N$91
  Bottom 0.406: U$5.R2 207.01,8.89 EDGE5.R2
N$92
  Bottom 0.406: U$5.B2 245.11,8.89 EDGE5.B2
N$93
  Bottom 0.406: U$5.U2 196.85,16.51 198.12,15.24 198.12,8.89 EDGE5.U2
N$94
  Top 0.406: U$5.A1 248.92,8.89 EDGE5.A1
N$95
  Top 0.406: U$5.V1 195.58,16.51 194.31,15.24 194.31,8.89 EDGE5.V1
N$96
  Top 0.406: U$5.U1 198.12,8.89 EDGE5.U1
N$97
  Top 0.406: U$5.T1 201.93,16.51 200.66,15.24 200.66,8.89 EDGE5.T1
N$98
  Top 0.406: U$5.S1 204.47,8.89 EDGE5.S1
N$99
  Top 0.406: U$5.R1 208.28,16.51 207.01,15.24 207.01,8.89 EDGE5.R1
N$100
  Top 0.406: U$5.P1 210.82,8.89 EDGE5.P1
N$101
  Top 0.406: U$5.N1 214.63,16.51 213.36,15.24 213.36,8.89 EDGE5.N1
N$102
  Top 0.406: U$5.M1 217.17,8.89 EDGE5.M1
N$103
  Top 0.406: U$5.L1 220.98,16.51 219.71,15.24 219.71,8.89 EDGE5.L1
N$104
  Top 0.406: U$5.K1 223.52,8.89 EDGE5.K1
N$105
  Top 0.406: U$5.J1 227.33,16.51 226.06,15.24 226.06,8.89 EDGE5.J1
N$106
  Top 0.406: U$5.H1 229.87,8.89 EDGE5.H1
N$107
  Top 0.406: U$5.F1 233.68,16.51 232.41,15.24 232.41,8.89 EDGE5.F1
N$108
  Top 0.406: U$5.E1 236.22,8.89 EDGE5.E1
N$109
  Top 0.406: U$5.D1 240.03,16.51 238.76,15.24 238.76,8.89 EDGE5.D1
N$110
  Top 0.406: U$5.C1 242.57,8.89 EDGE5.C1
N$111
  Top 0.406: U$5.B1 246.38,16.51 245.11,15.24 245.11,8.89 EDGE5.B1
OE(0)1
  Top 0.406: IC6.1 39.37,96.52 53.34,82.55 53.34,35.56 34.29,35.56 IC3.8
  Bottom 0.406: IC6.19 36.83,95.25 39.37,97.79 IC6.1 | IC3.8 33.02,34.29 33.02,44.45 IC1.22
OE(0)2
  Top 0.406: IC7.1 105.41,92.71 113.03,85.09 113.03,68.58 106.68,68.58 106.68,48.26 99.06,48.26 97.79,49.53 IC2.22
  Bottom 0.406: IC7.19 105.41,88.9 IC7.1 | IC5.8 95.25,25.4 100.33,25.4 100.33,29.21 99.06,30.48 99.06,48.26 97.79,49.53 IC2.22
PARITY
  Bottom 0.406: 81.28,78.74 83.82,78.74 85.09,80.01 IC8.9 | 81.28,78.74 81.28,83.82 82.55,85.09 IC7.11 | 81.28,78.74 81.28,63.5 82.55,62.23 IC2.16
STROBE(0)  (3 unrouted)
  Top 0.406: U$5.P2 214.63,25.4 214.63,38.1 IC9.6
  Bottom 0.406: SV4.45 200.66,95.25 196.85,95.25 196.85,40.64 198.12,39.37 215.9,39.37 IC9.6 | U$5.P2 209.55,16.51 210.82,15.24 210.82,8.89 EDGE5.P2
VCC  (via drill 0.81)  (3 unrouted)
  Top 0.406: v110.49,27.94 114.3,27.94 120.65,21.59 U$2.A2 | v111.76,73.66 IC8.20 | R1.1 247.65,38.1 U$5.A2 | IC11.3 222.25,76.2 IC11.16 C2.1 | IC9.4 214.63,43.18 IC10.10 209.55,45.72 IC10.4 | IC10.1 IC10.14 IC9.1
  Bottom 0.406: IC6.20 39.37,90.17 38.1,88.9 38.1,77.47 IC4.20 40.64,74.93 40.64,67.31 45.72,62.23 45.72,49.53 IC1.28 48.26,44.45 48.26,34.29 IC3.14 46.99,30.48 U$1.A2 57.15,16.51 58.42,15.24 58.42,8.89 EDGE1.A2 | IC7.20 105.41,85.09 104.14,83.82 104.14,77.47 105.41,76.2 IC8.20 | v110.49,27.94 IC5.14 110.49,35.56 113.03,38.1 IC2.28 111.76,52.07 v111.76,73.66 | U$2.A2 120.65,16.51 121.92,15.24 121.92,8.26 EDGE2.A2 | 219.71,53.34 IC9.14 227.33,55.88 R1.1 | 219.71,53.34 IC9.1 | IC10.14 IC10.13 207.01,45.72 IC10.4 | 219.71,53.34 219.71,68.58 IC11.3 | U$5.A2 247.65,16.51 248.92,15.24 248.92,8.89 EDGE5.A2 | U$3.A2 184.15,16.51 185.42,15.24 185.42,8.89 EDGE3.A2
WE(0)  (via drill 0.81)  (1 unrouted)
  Top 0.406: v106.68,76.2 105.41,76.2 IC8.19 | v69.85,100.33 83.82,100.33 87.63,96.52 91.44,96.52 91.44,91.44 93.98,91.44 95.25,90.17 101.6,90.17 104.14,87.63 104.14,82.55 IC8.1
  Bottom 0.406: IC2.27 110.49,59.69 109.22,60.96 109.22,72.39 106.68,74.93 v106.68,76.2 105.41,77.47 IC8.1 | SV1.3 73.66,41.91 71.12,41.91 71.12,53.34 69.85,54.61 v69.85,100.33
WRITE(0)  (1 unrouted)
  Top 0.406: IC4.19 36.83,81.28 IC4.1 38.1,85.09 35.56,85.09 30.48,90.17 30.48,92.71 40.64,92.71 48.26,85.09 48.26,46.99 IC1.27 46.99,43.18 13.97,43.18 SV2.3 | IC10.6 SV4.3

### Text on the board
Top: 8i H01 | 8i H03 | 8i H02 | 8i H05
Bottom: 8i H01 | 8i H02 | 8i H03 | 8i H05
tValues: 8i H01 | 8i H03 | 8i H02 | 8i H05